# EAGLE board Cynara Viride (EAGLE 7.5.0), part 1 of 2
PCB_FINISH: ENIG; PCB_NAME: CynaraViride; PCB_SIZE_LENGTH: 160; PCB_SIZE_WIDTH: 100; PCB_X_REPEATS: 1; PCB_X_STEP: 0; PCB_Y_REPEATS: 1; PCB_Y_STEP: 0
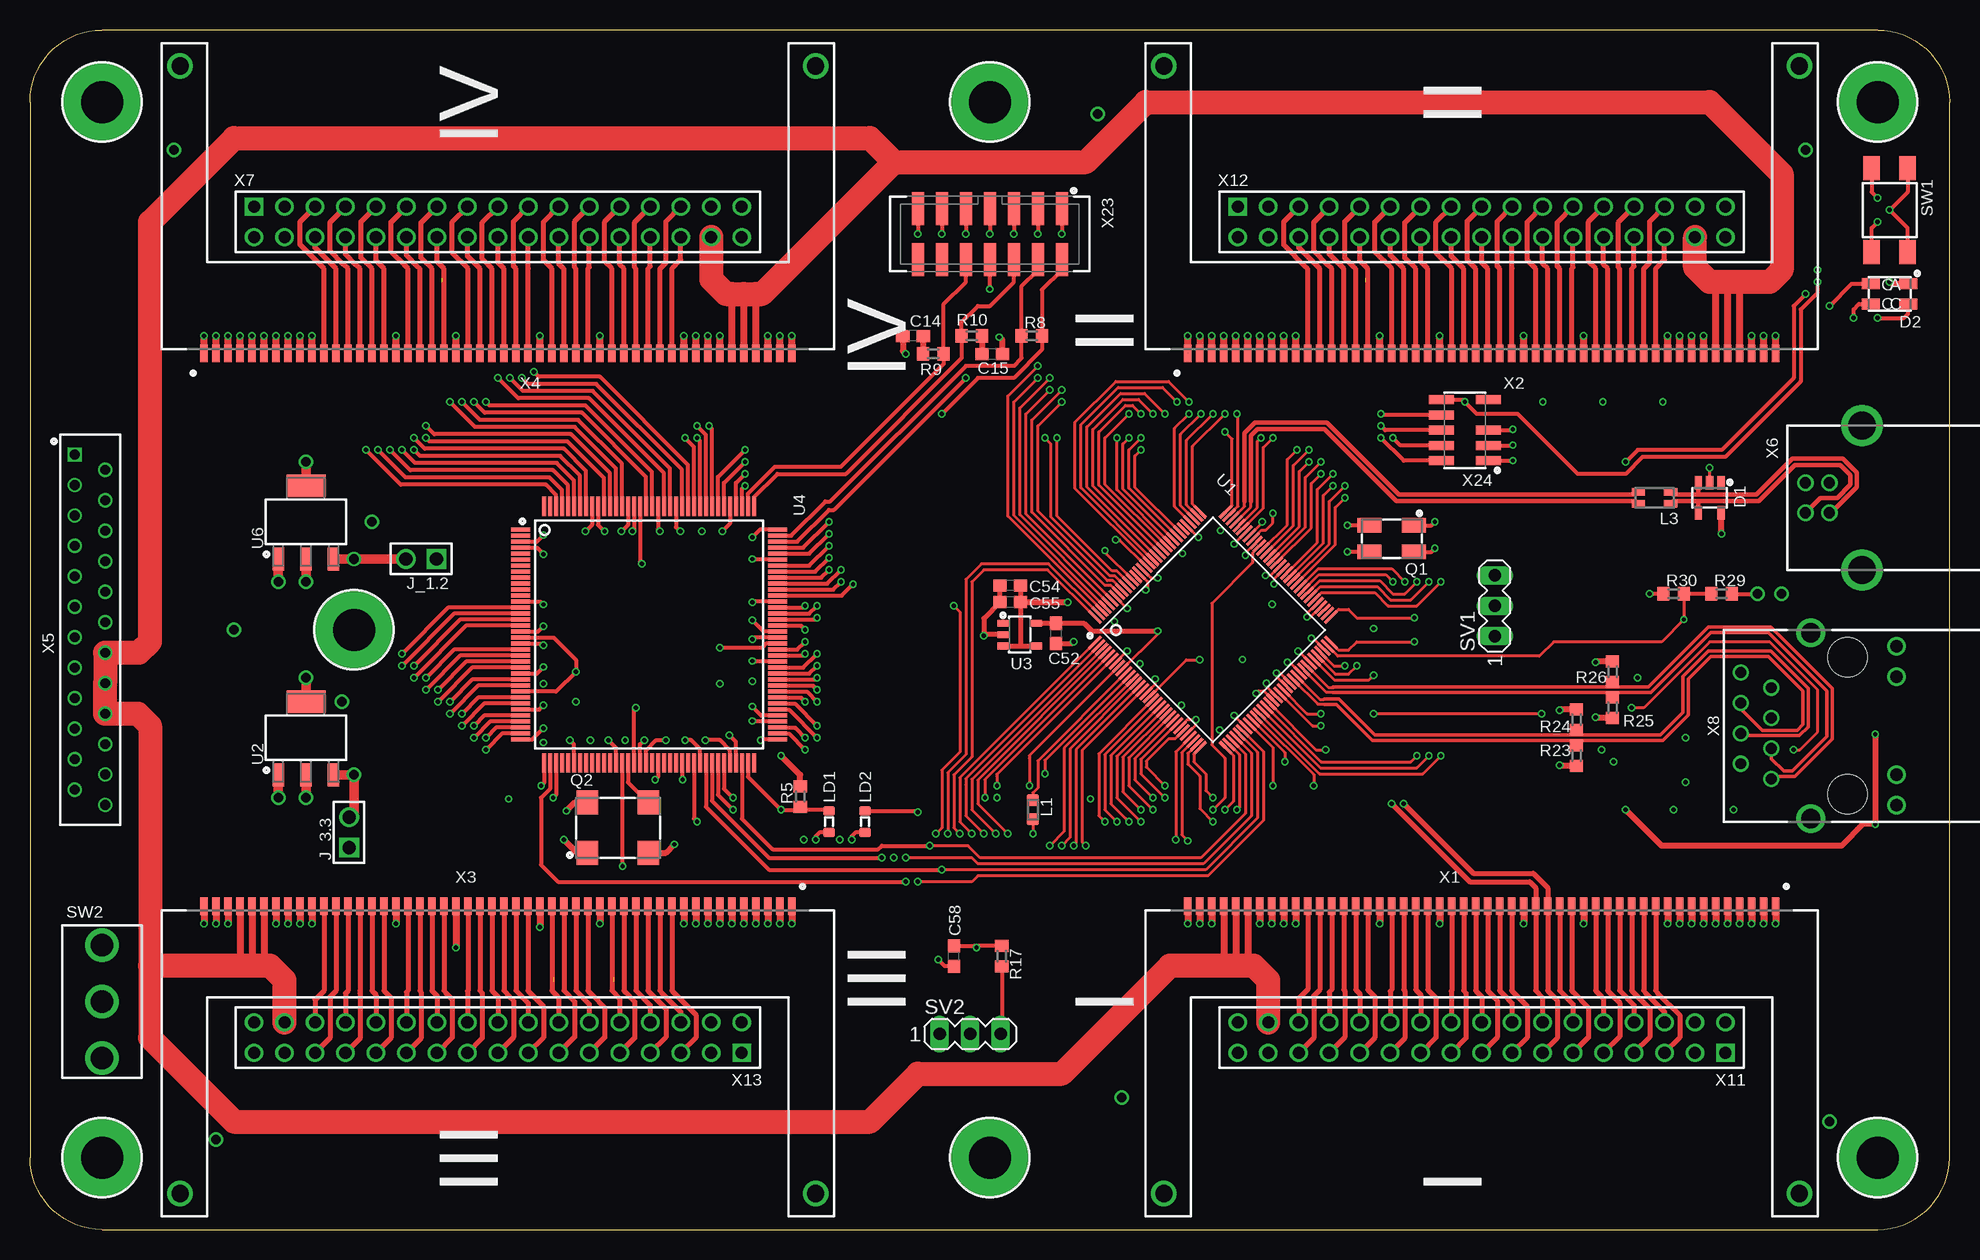
[diagram p9: board, top side]
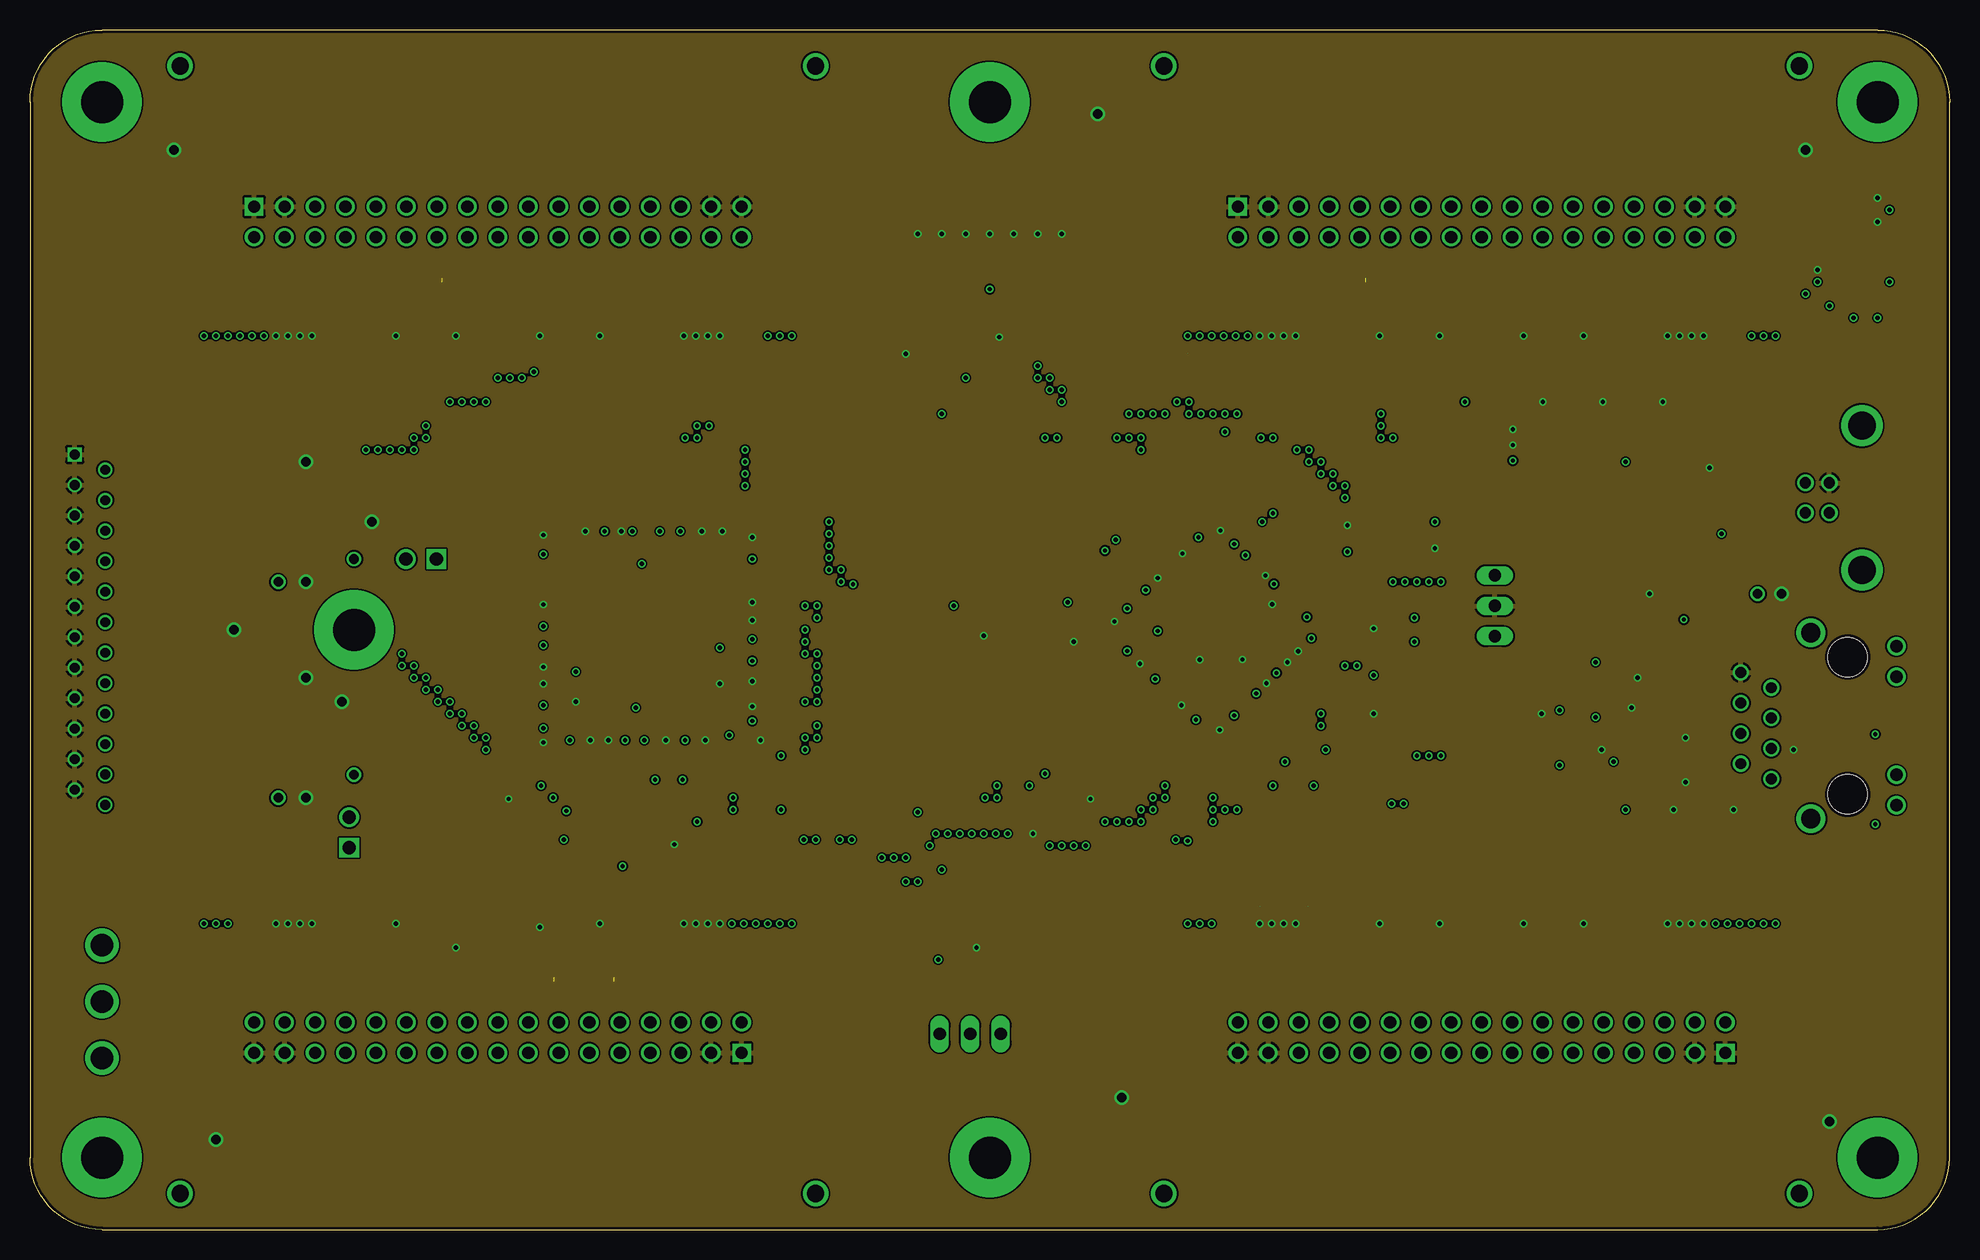
[diagram p10: board, inner layer InnerSolder]
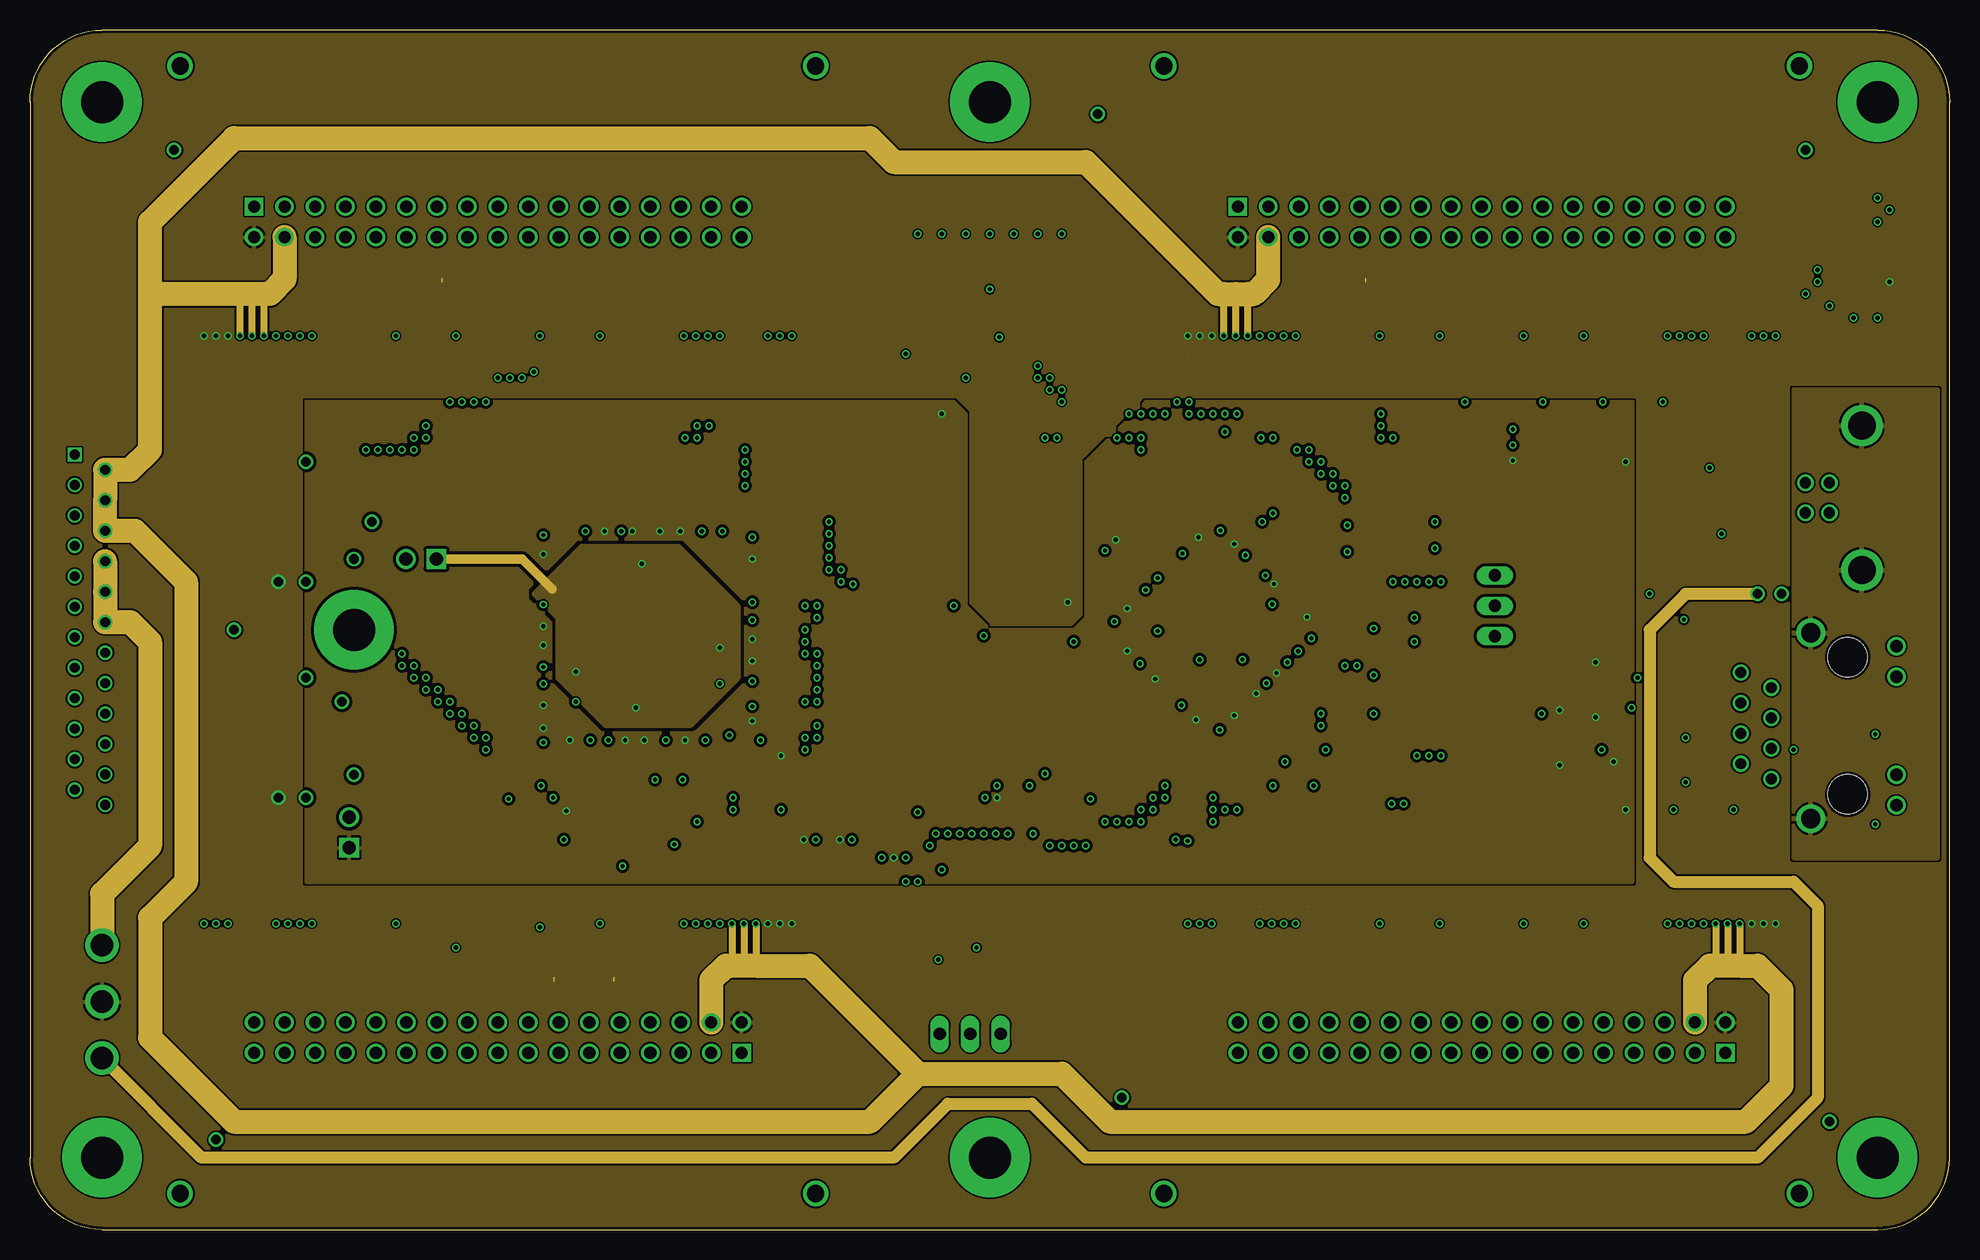
[diagram p11: board, inner layer Route15]
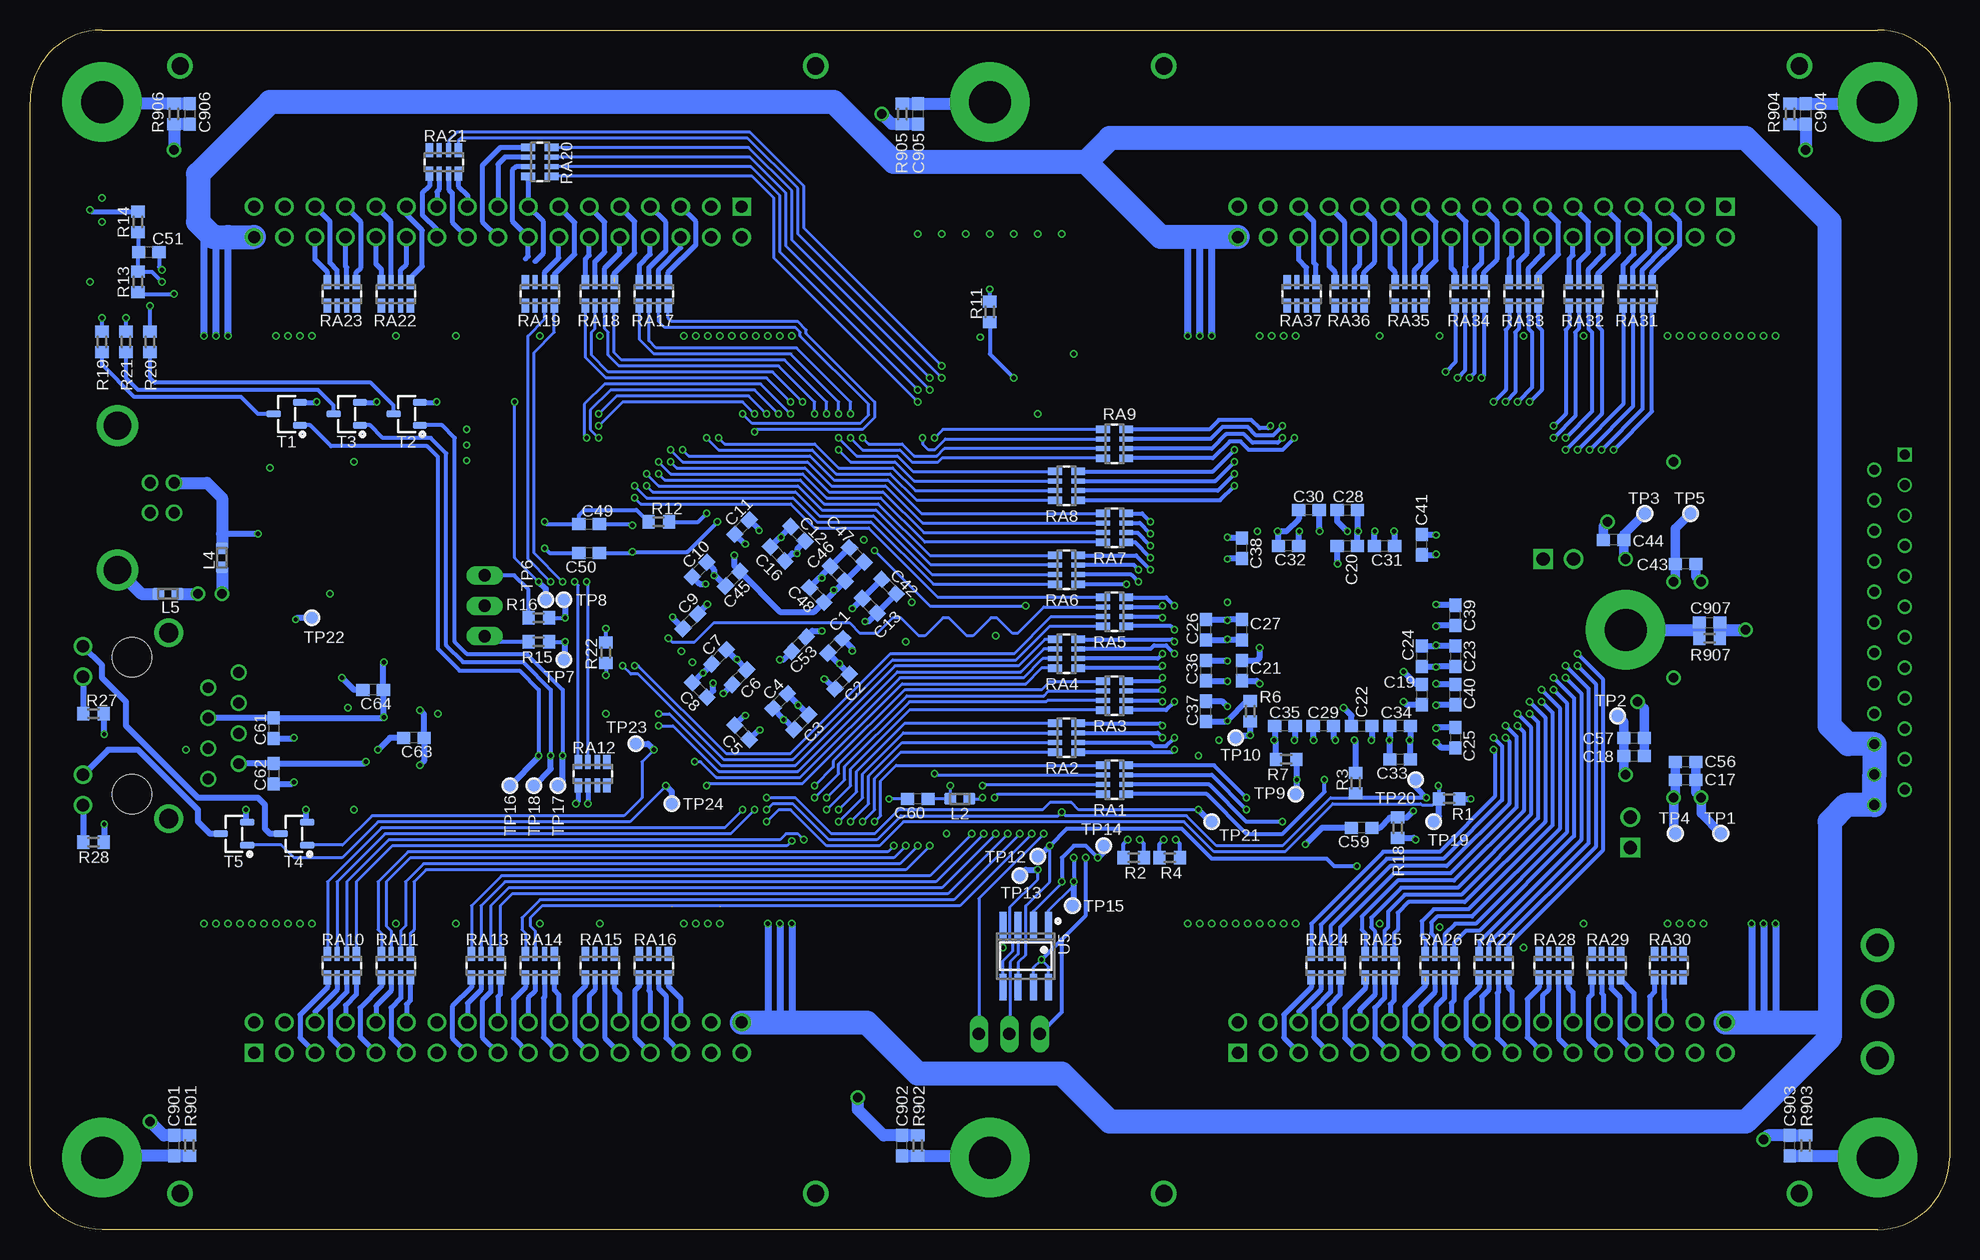
[diagram p12: board, bottom side, seen from below]

Size 160 x 100 mm. Coordinates in mm from the lower left corner, seen from the top.
Outline: 6,0 154,0 arc90 160,6 160,94 arc90 154,100 6,100 arc90 0,94 0,6 arc90 6,0
Copper layers (1+2*15+16): Top 0.018mm / dielectric 0.36mm / InnerSolder 0.035mm / dielectric 0.71mm / Route15 0.035mm / dielectric 0.2mm / Bottom 0.018mm
Design rules "eC_4Layer_PClass6_BaseCopperO18-I35_eCDefault *": minimum track width 0.15mm, minimum drill 0.35mm, track to track 0.15mm, track to pad 0.15mm, pad to pad 0.15mm, via to via 0.15mm, smd to smd 0mil, copper to edge 0.25mm, drill to drill 0.35mm, minimum pad ring 0.125mm, minimum via ring 0.125mm, stop-mask expansion 0mil, vias tented up to drill 0.45mm, thermal gap 0.2mm

## Footprints (pad centres in the part's own frame; a part is rotated, then mirrored left to right if it is on the bottom)
C0603 = smd 1.1 x 1: 1 -0.85,0; 2 0.85,0
WE-TVS_SOT23-5L = smd 0.6 x 1.1: 1 -0.95,-1.25; 2 0,-1.25; 3 0.95,-1.25; 4 0.95,1.25; 5 -0.95,1.25
3528-COMMON-ANODE = smd 1.5 x 0.9: 1 1.55,0.85; 2 1.55,-0.85; 3 -1.55,0.85; 4 -1.55,-0.85
HOLE-3,5/6,6 = drill 3.5 pad 6.6: 1 0,0
1X2 = drill 1.1 square: 1 -1.27,0 | drill 1.1: 2 1.27,0
L1608 = smd 1 x 1: 1 -0.8,0; 2 0.8,0
WE-CNSW_1206 = smd 1.1 x 0.6: 1 1.35,-0.5; 2 -1.35,-0.5; 3 -1.35,0.5; 4 1.35,0.5
LED_1608 = smd 0.8 x 1: A 0.9,0; C -0.9,0
TXC-7B = smd 2 x 1.2: 1 -1.85,-1.1; 2 1.85,-1.1; 3 1.85,1.1; 4 -1.85,1.1
TXC-7W = smd 1.8 x 2: 1 -2.54,-2.1; 2 2.54,-2.1; 3 2.54,2.1; 4 -2.54,2.1
R0603 = smd 1 x 1.1: 1 -0.85,0; 2 0.85,0
CRA06S = smd 1.15 x 0.63: 1A -0.975,1.2; 1B 0.975,1.2; 4A -0.975,-1.2; 4B 0.975,-1.2 | smd 1.15 x 0.44: 2A -0.975,0.4; 2B 0.975,0.4; 3A -0.975,-0.4; 3B 0.975,-0.4
MA03-1 = drill 1.016 long: 1 -2.54,0; 2 0,0; 3 2.54,0
430181038816 = smd 2 x 1.4: 1 -3.5,1.5; 2 3.5,1.5; 3 -3.5,-1.5; 4 3.5,-1.5
1XXX-MX-XX-C = drill 1.85: 1 0,-4.7; 2 0,0; 3 0,4.7
SOT23-3 = smd 1.2 x 0.6: 1 -1.1,0.95; 2 -1.1,-0.95; 3 1.1,0
TP-SMD = smd 1.2 x 1.2: 1 0,0
S-PQFP-G128 = smd 0.24 x 1.4: 1 -6.2,-7.7; 2 -5.8,-7.7; 3 -5.4,-7.7; 4 -5,-7.7; 5 -4.6,-7.7; 6 -4.2,-7.7; 7 -3.8,-7.7; 8 -3.4,-7.7; 9 -3,-7.7; 10 -2.6,-7.7; 11 -2.2,-7.7; 12 -1.8,-7.7; 13 -1.4,-7.7; 14 -1,-7.7; 15 -0.6,-7.7; 16 -0.2,-7.7; 17 0.2,-7.7; 18 0.6,-7.7; 19 1,-7.7; 20 1.4,-7.7; 21 1.8,-7.7; 22 2.2,-7.7; 23 2.6,-7.7; 24 3,-7.7; 25 3.4,-7.7; 26 3.8,-7.7; 27 4.2,-7.7; 28 4.6,-7.7; 29 5,-7.7; 30 5.4,-7.7; 31 5.8,-7.7; 32 6.2,-7.7; 65 6.2,7.7; 66 5.8,7.7; 67 5.4,7.7; 68 5,7.7; 69 4.6,7.7; 70 4.2,7.7; 71 3.8,7.7; 72 3.4,7.7; 73 3,7.7; 74 2.6,7.7; 75 2.2,7.7; 76 1.8,7.7; 77 1.4,7.7; 78 1,7.7; 79 0.6,7.7; 80 0.2,7.7; 81 -0.2,7.7; 82 -0.6,7.7; 83 -1,7.7; 84 -1.4,7.7; 85 -1.8,7.7; 86 -2.2,7.7; 87 -2.6,7.7; 88 -3,7.7; 89 -3.4,7.7; 90 -3.8,7.7; 91 -4.2,7.7; 92 -4.6,7.7; 93 -5,7.7; 94 -5.4,7.7; 95 -5.8,7.7; 96 -6.2,7.7 | smd 1.4 x 0.24: 33 7.7,-6.2; 34 7.7,-5.8; 35 7.7,-5.4; 36 7.7,-5; 37 7.7,-4.6; 38 7.7,-4.2; 39 7.7,-3.8; 40 7.7,-3.4; 41 7.7,-3; 42 7.7,-2.6; 43 7.7,-2.2; 44 7.7,-1.8; 45 7.7,-1.4; 46 7.7,-1; 47 7.7,-0.6; 48 7.7,-0.2; 49 7.7,0.2; 50 7.7,0.6; 51 7.7,1; 52 7.7,1.4; 53 7.7,1.8; 54 7.7,2.2; 55 7.7,2.6; 56 7.7,3; 57 7.7,3.4; 58 7.7,3.8; 59 7.7,4.2; 60 7.7,4.6; 61 7.7,5; 62 7.7,5.4; 63 7.7,5.8; 64 7.7,6.2; 97 -7.7,6.2; 98 -7.7,5.8; 99 -7.7,5.4; 100 -7.7,5; 101 -7.7,4.6; 102 -7.7,4.2; 103 -7.7,3.8; 104 -7.7,3.4; 105 -7.7,3; 106 -7.7,2.6; 107 -7.7,2.2; 108 -7.7,1.8; 109 -7.7,1.4; 110 -7.7,1; 111 -7.7,0.6; 112 -7.7,0.2; 113 -7.7,-0.2; 114 -7.7,-0.6; 115 -7.7,-1; 116 -7.7,-1.4; 117 -7.7,-1.8; 118 -7.7,-2.2; 119 -7.7,-2.6; 120 -7.7,-3; 121 -7.7,-3.4; 122 -7.7,-3.8; 123 -7.7,-4.2; 124 -7.7,-4.6; 125 -7.7,-5; 126 -7.7,-5.4; 127 -7.7,-5.8; 128 -7.7,-6.2
SOT-223 = smd 1.9 x 0.95: 1 -3.1,2.3; 2 -3.1,0; 3 -3.1,-2.3 | smd 1.9 x 3.25: 4 3,0
DBV(R-PDSO-G5) = smd 0.55 x 1: 1 -0.95,-1.35; 2 0,-1.35; 3 0.95,-1.35; 4 0.95,1.35; 5 -0.95,1.35
TQG144 = smd 0.35 x 1.6: 1 -8.35,-11.1; 2 -7.85,-11.1; 3 -7.35,-11.1; 4 -6.85,-11.1; 5 -6.35,-11.1; 6 -5.85,-11.1; 7 -5.35,-11.1; 8 -4.85,-11.1; 9 -4.35,-11.1; 10 -3.85,-11.1; 11 -3.35,-11.1; 12 -2.85,-11.1; 13 -2.35,-11.1; 14 -1.85,-11.1; 15 -1.35,-11.1; 16 -0.85,-11.1; 17 -0.35,-11.1; 18 0.15,-11.1; 19 0.65,-11.1; 20 1.15,-11.1; 21 1.65,-11.1; 22 2.15,-11.1; 23 2.65,-11.1; 24 3.15,-11.1; 25 3.65,-11.1; 26 4.15,-11.1; 27 4.65,-11.1; 28 5.15,-11.1; 29 5.65,-11.1; 30 6.15,-11.1; 31 6.65,-11.1; 32 7.15,-11.1; 33 7.65,-11.1; 34 8.15,-11.1; 35 8.65,-11.1; 36 9.15,-11.1; 73 9.15,10.3; 74 8.65,10.3; 75 8.15,10.3; 76 7.65,10.3; 77 7.15,10.3; 78 6.65,10.3; 79 6.15,10.3; 80 5.65,10.3; 81 5.15,10.3; 82 4.65,10.3; 83 4.15,10.3; 84 3.65,10.3; 85 3.15,10.3; 86 2.65,10.3; 87 2.15,10.3; 88 1.65,10.3; 89 1.15,10.3; 90 0.65,10.3; 91 0.15,10.3; 92 -0.35,10.3; 93 -0.85,10.3; 94 -1.35,10.3; 95 -1.85,10.3; 96 -2.35,10.3; 97 -2.85,10.3; 98 -3.35,10.3; 99 -3.85,10.3; 100 -4.35,10.3; 101 -4.85,10.3; 102 -5.35,10.3; 103 -5.85,10.3; 104 -6.35,10.3; 105 -6.85,10.3; 106 -7.35,10.3; 107 -7.85,10.3; 108 -8.35,10.3 | smd 1.6 x 0.35: 37 11.1,-9.15; 38 11.1,-8.65; 39 11.1,-8.15; 40 11.1,-7.65; 41 11.1,-7.15; 42 11.1,-6.65; 43 11.1,-6.15; 44 11.1,-5.65; 45 11.1,-5.15; 46 11.1,-4.65; 47 11.1,-4.15; 48 11.1,-3.65; 49 11.1,-3.15; 50 11.1,-2.65; 51 11.1,-2.15; 52 11.1,-1.65; 53 11.1,-1.15; 54 11.1,-0.65; 55 11.1,-0.15; 56 11.1,0.35; 57 11.1,0.85; 58 11.1,1.35; 59 11.1,1.85; 60 11.1,2.35; 61 11.1,2.85; 62 11.1,3.35; 63 11.1,3.85; 64 11.1,4.35; 65 11.1,4.85; 66 11.1,5.35; 67 11.1,5.85; 68 11.1,6.35; 69 11.1,6.85; 70 11.1,7.35; 71 11.1,7.85; 72 11.1,8.35; 109 -10.3,8.35; 110 -10.3,7.85; 111 -10.3,7.35; 112 -10.3,6.85; 113 -10.3,6.35; 114 -10.3,5.85; 115 -10.3,5.35; 116 -10.3,4.85; 117 -10.3,4.35; 118 -10.3,3.85; 119 -10.3,3.35; 120 -10.3,2.85; 121 -10.3,2.35; 122 -10.3,1.85; 123 -10.3,1.35; 124 -10.3,0.85; 125 -10.3,0.35; 126 -10.3,-0.15; 127 -10.3,-0.65; 128 -10.3,-1.15; 129 -10.3,-1.65; 130 -10.3,-2.15; 131 -10.3,-2.65; 132 -10.3,-3.15; 133 -10.3,-3.65; 134 -10.3,-4.15; 135 -10.3,-4.65; 136 -10.3,-5.15; 137 -10.3,-5.65; 138 -10.3,-6.15; 139 -10.3,-6.65; 140 -10.3,-7.15; 141 -10.3,-7.65; 142 -10.3,-8.15; 143 -10.3,-8.65; 144 -10.3,-9.15
SOIC127P600X120-8N = smd 2.2 x 0.6: 1 -2.6,1.905; 2 -2.6,0.635; 3 -2.6,-0.635; 4 -2.6,-1.905; 5 2.6,-1.905; 6 2.6,-0.635; 7 2.6,0.635; 8 2.6,1.905
MB1-150-01-XX-S-XX-SL = smd 0.61 x 1.448: 1 24.5,23.95; 2 23.5,23.95; 3 22.5,23.95; 4 21.5,23.95; 5 20.5,23.95; 6 19.5,23.95; 7 18.5,23.95; 8 17.5,23.95; 9 16.5,23.95; 10 15.5,23.95; 11 14.5,23.95; 12 13.5,23.95; 13 12.5,23.95; 14 11.5,23.95; 15 10.5,23.95; 16 9.5,23.95; 17 8.5,23.95; 18 7.5,23.95; 19 6.5,23.95; 20 5.5,23.95; 21 4.5,23.95; 22 3.5,23.95; 23 2.5,23.95; 24 1.5,23.95; 25 0.5,23.95; 26 -0.5,23.95; 27 -1.5,23.95; 28 -2.5,23.95; 29 -3.5,23.95; 30 -4.5,23.95; 31 -5.5,23.95; 32 -6.5,23.95; 33 -7.5,23.95; 34 -8.5,23.95; 35 -9.5,23.95; 36 -10.5,23.95; 37 -11.5,23.95; 38 -12.5,23.95; 39 -13.5,23.95; 40 -14.5,23.95; 41 -15.5,23.95; 42 -16.5,23.95; 43 -17.5,23.95; 44 -18.5,23.95; 45 -19.5,23.95; 46 -20.5,23.95; 47 -21.5,23.95; 48 -22.5,23.95; 49 -23.5,23.95; 50 -24.5,23.95 | drill 1.422 pad 2.032: 51 26.491,0; 52 -26.491,0
MICROMATCH-24-MALE = drill 0.8 square: 1 14.605,1.27 | drill 0.8: 2 13.335,-1.27; 3 12.065,1.27; 4 10.795,-1.27; 5 9.525,1.27; 6 8.255,-1.27; 7 6.985,1.27; 8 5.715,-1.27; 9 4.445,1.27; 10 3.175,-1.27; 11 1.905,1.27; 12 0.635,-1.27; 13 -0.635,1.27; 14 -1.905,-1.27; 15 -3.175,1.27; 16 -4.445,-1.27; 17 -5.715,1.27; 18 -6.985,-1.27; 19 -8.255,1.27; 20 -9.525,-1.27; 21 -10.795,1.27; 22 -12.065,-1.27; 23 -13.335,1.27; 24 -14.605,-1.27
61400416121 = drill 0.92: 1 -1.25,-4.71; 2 1.25,-4.71; 3 1.25,-2.71; 4 -1.25,-2.71 | drill 2.3: Z1 6.02,0; Z2 -6.02,0
2X17P-FEMALE = drill 1.02 square: 1 -20.32,1.27 | drill 1.02: 2 -20.32,-1.27; 3 -17.78,1.27; 4 -17.78,-1.27; 5 -15.24,1.27; 6 -15.24,-1.27; 7 -12.7,1.27; 8 -12.7,-1.27; 9 -10.16,1.27; 10 -10.16,-1.27; 11 -7.62,1.27; 12 -7.62,-1.27; 13 -5.08,1.27; 14 -5.08,-1.27; 15 -2.54,1.27; 16 -2.54,-1.27; 17 0,1.27; 18 0,-1.27; 19 2.54,1.27; 20 2.54,-1.27; 21 5.08,1.27; 22 5.08,-1.27; 23 7.62,1.27; 24 7.62,-1.27; 25 10.16,1.27; 26 10.16,-1.27; 27 12.7,1.27; 28 12.7,-1.27; 29 15.24,1.27; 30 15.24,-1.27; 31 17.78,1.27; 32 17.78,-1.27; 33 20.32,1.27; 34 20.32,-1.27
74990-WITH-LED-TYPE1 = drill 0.9: 1 4.445,-6.35; 2 3.175,-8.89; 3 1.905,-6.35; 4 0.635,-8.89; 5 -0.635,-6.35; 6 -1.905,-8.89; 7 -3.175,-6.35; 8 -4.445,-8.89 | drill 1.02: 9 6.625,4.08; 10 4.085,4.08; 11 -4.085,4.08; 12 -6.625,4.08 | drill 1.6: Z1 -7.745,-3.05; Z2 7.745,-3.05 | hole 3.25: 5.715,0; -5.715,0
87832-1420 = smd 1 x 2.75: 1 -6,-2.125; 2 -6,2.125; 3 -4,-2.125; 4 -4,2.125; 5 -2,-2.125; 6 -2,2.125; 7 0,-2.125; 8 0,2.125; 9 2,-2.125; 10 2,2.125; 11 4,-2.125; 12 4,2.125; 13 6,-2.125; 14 6,2.125
DEBUG-CORTEXM10 = smd 0.75 x 2.1: 1 -1.905,-1.95; 2 -1.905,1.95; 3 -0.635,-1.95; 4 -0.635,1.95; 5 0.635,-1.95; 6 0.635,1.95; 8 1.905,1.95; 9 3.175,-1.95; 10 3.175,1.95

## Placement (x,y rotation side)
C1  100nF  [C0603]  92.87,48.66 225 bottom
C2  100nF  [C0603]  92.31,45.69 45 bottom
C3  100nF  [C0603]  95.7,42.29 45 bottom
C4  100nF  [C0603]  97.47,44.06 45 bottom
C5  100nF  [C0603]  100.65,41.44 315 bottom
C6  100nF  [C0603]  100.86,46.04 45 bottom
C7  100nF  [C0603]  102.56,47.74 45 bottom
C8  100nF  [C0603]  104.19,44.98 315 bottom
C9  100nF  [C0603]  104.96,50.71 45 bottom
C10  100nF  [C0603]  104.19,55.02 45 bottom
C11  100nF  [C0603]  100.65,58.56 45 bottom
C12  100nF  [C0603]  95.98,57.99 315 bottom
C13  100nF  [C0603]  90,52 315 bottom
C14  47pF  [C0603]  73.6,74.5 180 top
C15  47pF  [C0603]  80.2,73 0 top
C16  2u2  [C0603]  97.69,56.32 315 bottom
C17  4u7  [C0603]  22,37.5 180 bottom
C18  1uF  [C0603]  26.3,39.5 0 bottom
C19  4u7  [C0603]  44,44.6 270 bottom
C20  4u7  [C0603]  50.2,57 0 bottom
C21  4u7  [C0603]  59,46.6 270 bottom
C22  470nF  [C0603]  49,42 0 bottom
C23  4u7  [C0603]  41.2,47.8 270 bottom
C24  4u7  [C0603]  44,47.8 270 bottom
C25  4u7  [C0603]  41.2,41 270 bottom
C26  4u7  [C0603]  62,50 90 bottom
C27  4u7  [C0603]  59,50 90 bottom
C28  4u7  [C0603]  50.2,60 0 bottom
C29  470nF  [C0603]  52.2,42 180 bottom
C30  4u7  [C0603]  53.4,60 180 bottom
C31  470nF  [C0603]  47.1,57 0 bottom
C32  470nF  [C0603]  55.1,57 180 bottom
C33  4u7  [C0603]  45.8,39.2 180 bottom
C34  470nF  [C0603]  45.8,42 180 bottom
C35  470nF  [C0603]  55.4,42 180 bottom
C36  4u7  [C0603]  62,46.6 270 bottom
C37  470nF  [C0603]  62,43.2 90 bottom
C38  470nF  [C0603]  59,56.8 90 bottom
C39  4u7  [C0603]  41.2,51.2 90 bottom
C40  470nF  [C0603]  41.2,44.6 90 bottom
C41  470nF  [C0603]  44,57.1 90 bottom
C42  2u2  [C0603]  88.4,53.6 315 bottom
C43  4u7  [C0603]  22,55.5 180 bottom
C44  1uF  [C0603]  28,57.5 180 bottom
C45  100nF  [C0603]  101.43,54.24 225 bottom
C46  2u2  [C0603]  92.66,54.67 135 bottom
C47  1uF  [C0603]  91.09,56.23 135 bottom
C48  100nF  [C0603]  94.43,52.9 135 bottom
C49  22pF  [C0603]  113.4,58.8 0 bottom
C50  22pF  [C0603]  113.4,56.4 180 bottom
C51  10nF  [C0603]  150.1,81.5 0 bottom
C52  100nF  [C0603]  85.5,49.7 270 top
C53  2u2  [C0603]  95.9,48.8 225 bottom
C54  2u2  [C0603]  81.7,53.7 180 top
C55  100nF  [C0603]  81.7,52.3 180 top
C56  100nF  [C0603]  22,39 180 bottom
C57  100nF  [C0603]  26.3,41 0 bottom
C58  100nF  [C0603]  77,22.8 90 top
C59  100nF  [C0603]  49,33.5 180 bottom
C60  100nF  [C0603]  86,35.9 180 bottom
C61  100uF  [C0603]  139.7,41.8 270 bottom
C62  100uF  [C0603]  139.7,38 270 bottom
C63  100uF  [C0603]  128,41 180 bottom
C64  100uF  [C0603]  131.4,45 180 bottom
C901  100nF  [C0603]  148,7 90 bottom
C902  100nF  [C0603]  87.3,7 90 bottom
C903  100nF  [C0603]  13.3,7 90 bottom
C904  100nF  [C0603]  12,93 270 bottom
C905  100nF  [C0603]  86,93 270 bottom
C906  100nF  [C0603]  146.7,93 270 bottom
C907  100nF  [C0603]  20,50.6 0 bottom
D1  WE-TVS_824011  [WE-TVS_SOT23-5L]  140,61 180 top
D2  WL-SFTW-150141M173100-R&G&B  [3528-COMMON-ANODE]  155,78 0 top
G901  [HOLE-3,5/6,6]  154,6 0 top
G902  [HOLE-3,5/6,6]  80,6 0 top
G903  [HOLE-3,5/6,6]  6,6 0 top
G904  [HOLE-3,5/6,6]  6,94 0 top
G905  [HOLE-3,5/6,6]  80,94 0 top
G906  [HOLE-3,5/6,6]  154,94 0 top
G907  [HOLE-3,5/6,6]  27,50 0 top
J_1.2  HDR1X2  [1X2]  32.6,55.9 180 top
J_3.3  HDR1X2  [1X2]  26.6,33.1 90 top
L1  26Z@100MHz  [L1608]  83.6,35 270 top
L2  26Z@100MHz  [L1608]  82.5,35.9 0 bottom
L3  [WE-CNSW_1206]  135.4,61 180 top
L4  300R@100MHz  [L1608]  144,56 90 bottom
L5  26Z@100MHz  [L1608]  148.5,53 180 bottom
LD1  GREEN 0603  [LED_1608]  66.6,34 270 top
LD2  YELLOW 0603  [LED_1608]  69.6,34 270 top
Q1  TXC-7B  [TXC-7B]  113.5,57.6 180 top
Q2  TXC-7WNEO  [TXC-7W]  49,33.5 0 top
R1  4k7  [R0603]  41.7,35.9 180 bottom
R2  330E  [R0603]  68,31 0 bottom
R3  4k7  [R0603]  49.5,37.2 90 bottom
R4  330E  [R0603]  65,31 0 bottom
R5  4k7  [R0603]  64.2,36.1 90 top
R6  4k7  [R0603]  58.3,43.2 90 bottom
R7  47E  [R0603]  55.3,39.2 0 bottom
R8  47k  [R0603]  83.5,74.5 0 top
R9  47E  [R0603]  75.3,73 0 top
R10  47E  [R0603]  78.5,74.5 180 top
R11  47E  [R0603]  80,76.5 90 bottom
R12  0E  [R0603]  107.6,59 0 bottom
R13  10k  [R0603]  151,79 270 bottom
R14  470E  [R0603]  151,84 270 bottom
R15  47E  [R0603]  117.6,49 0 bottom
R16  47E  [R0603]  117.6,51 0 bottom
R17  4k7  [R0603]  81,22.8 270 top
R18  0E  [R0603]  46,33.5 90 bottom
R19  70E  [R0603]  154,74 90 bottom
R20  130E  [R0603]  150,74 90 bottom
R21  70E  [R0603]  152,74 90 bottom
R22  4k87  [R0603]  112,48.1 270 bottom
R23  49E9  [R0603]  128.9,39.5 270 top
R24  49E9  [R0603]  128.9,42.5 90 top
R25  49E9  [R0603]  131.9,43.5 270 top
R26  49E9  [R0603]  131.9,46.5 90 top
R27  75E  [R0603]  154.7,43 0 bottom
R28  75E  [R0603]  154.7,32.3 0 bottom
R29  5.6K  [R0603]  141,53 0 top
R30  10K  [R0603]  137,53 0 top
R901  1M  [R0603]  146.7,7 270 bottom
R902  1M  [R0603]  86,7 270 bottom
R903  1M  [R0603]  12,7 270 bottom
R904  1M  [R0603]  13.3,93 90 bottom
R905  1M  [R0603]  87.3,93 90 bottom
R906  1M  [R0603]  148,93 90 bottom
R907  1M  [R0603]  20,49.3 180 bottom
RA1  100E  [CRA06S]  69.6,37.5 180 bottom
RA2  100E  [CRA06S]  73.6,41 180 bottom
RA3  100E  [CRA06S]  69.6,44.5 180 bottom
RA4  100E  [CRA06S]  73.6,48 180 bottom
RA5  100E  [CRA06S]  69.6,51.5 180 bottom
RA6  100E  [CRA06S]  73.6,55 180 bottom
RA7  100E  [CRA06S]  69.6,58.5 180 bottom
RA8  100E  [CRA06S]  73.6,62 180 bottom
RA9  100E  [CRA06S]  69.6,65.5 0 bottom
RA10  100E  [CRA06S]  134,22 90 bottom
RA11  100E  [CRA06S]  129.5,22 90 bottom
RA12  100E  [CRA06S]  113.1,38 90 bottom
RA13  100E  [CRA06S]  122,22 90 bottom
RA14  100E  [CRA06S]  117.5,22 90 bottom
RA15  100E  [CRA06S]  112.5,22 90 bottom
RA16  100E  [CRA06S]  108,22 90 bottom
RA17  100E  [CRA06S]  108,78 270 bottom
RA18  100E  [CRA06S]  112.5,78 270 bottom
RA19  100E  [CRA06S]  117.5,78 270 bottom
RA20  100E  [CRA06S]  117.5,89 180 bottom
RA21  100E  [CRA06S]  125.5,89 270 bottom
RA22  100E  [CRA06S]  129.5,78 270 bottom
RA23  100E  [CRA06S]  134,78 270 bottom
RA24  100E  [CRA06S]  52,22 90 bottom
RA25  100E  [CRA06S]  47.5,22 90 bottom
RA26  100E  [CRA06S]  42.5,22 90 bottom
RA27  100E  [CRA06S]  38,22 90 bottom
RA28  100E  [CRA06S]  33,22 90 bottom
RA29  100E  [CRA06S]  28.6,22 90 bottom
RA30  100E  [CRA06S]  23.4,22 90 bottom
RA31  100E  [CRA06S]  26,78 270 bottom
RA32  100E  [CRA06S]  30.5,78 270 bottom
RA33  100E  [CRA06S]  35.5,78 270 bottom
RA34  100E  [CRA06S]  40,78 270 bottom
RA35  100E  [CRA06S]  45,78 270 bottom
RA36  100E  [CRA06S]  50,78 270 bottom
RA37  100E  [CRA06S]  54,78 270 bottom
SV1  [MA03-1]  122.1,52 90 top
SV2  [MA03-1]  78.37,16.3 0 top
SW1  430181038816  [430181038816]  155,85 270 top
SW2  [1XXX-MX-XX-C]  6,19 0 top
T1  PDTC143  [SOT23-3]  138.6,68 180 bottom
T2  PDTC143  [SOT23-3]  128.6,68 180 bottom
T3  PDTC143  [SOT23-3]  133.6,68 180 bottom
T4  PDTC143  [SOT23-3]  138,33 180 bottom
T5  PDTC143  [SOT23-3]  143,33 180 bottom
TP1  [TP-SMD]  19.05,33.02 0 bottom
TP2  [TP-SMD]  27.67,42.82 0 bottom
TP3  [TP-SMD]  25.4,59.69 0 bottom
TP4  [TP-SMD]  22.86,33.02 0 bottom
TP5  [TP-SMD]  21.59,59.69 0 bottom
TP6  [TP-SMD]  117,52.5 0 bottom
TP7  [TP-SMD]  115.5,47.5 0 bottom
TP8  [TP-SMD]  115.5,52.5 0 bottom
TP9  [TP-SMD]  54.5,36.3 0 bottom
TP10  [TP-SMD]  59.5,41 0 bottom
TP12  [TP-SMD]  76,31.1 0 bottom
TP13  [TP-SMD]  77.5,29.5 0 bottom
TP14  [TP-SMD]  70.5,32 0 bottom
TP15  [TP-SMD]  73.1,27 0 bottom
TP16  [TP-SMD]  120,37 0 bottom
TP17  [TP-SMD]  116,37 0 bottom
TP18  [TP-SMD]  118,37 0 bottom
TP19  [TP-SMD]  43,34 180 bottom
TP20  [TP-SMD]  44.5,37.5 0 bottom
TP21  [TP-SMD]  61.5,34 0 bottom
TP22  [TP-SMD]  136.5,51 0 bottom
TP23  [TP-SMD]  109.5,40.5 0 bottom
TP24  [TP-SMD]  106.5,35.5 0 bottom
U1  TM4C129EN  [S-PQFP-G128]  98.6,50 315 top
U2  MCP1826S 3V3  [SOT-223]  23,41 90 top
U3  LM4132 3V3  [DBV(R-PDSO-G5)]  82.5,49.6 270 top
U4  XC6SLX9-3TQG  [TQG144]  52,50 270 top
U5  M25P16-SO8  [SOIC127P600X120-8N]  77,22.8 270 bottom
U6  MCP1826S 1V2  [SOT-223]  23,59 90 top
U$21  CYNARA_FRONT  [CYNARA_BELOW_W15MM]  87.6,54.9 90 top
X1  EDGE 50p  [MB1-150-01-XX-S-XX-SL]  121,3 0 top
X2  EDGE 50p  [MB1-150-01-XX-S-XX-SL]  121,97 180 top
X3  EDGE 50p  [MB1-150-01-XX-S-XX-SL]  39,3 0 top
X4  EDGE 50p  [MB1-150-01-XX-S-XX-SL]  39,97 180 top
X5  MicroMatch 24  [MICROMATCH-24-MALE]  5,50 90 top
X6  [61400416121]  152.7,61 270 top
X7  SOCK2X17  [2X17P-FEMALE]  39,84 0 top
X8  RJ45-LAN-10/100  [74990-WITH-LED-TYPE1]  151.5,42 270 top
X11  SOCK2X17  [2X17P-FEMALE]  121,16 180 top
X12  SOCK2X17  [2X17P-FEMALE]  121,84 0 top
X13  SOCK2X17  [2X17P-FEMALE]  39,16 180 top
X23  debug xilinx  [87832-1420]  80,83 180 top
X24  debug 10p  [DEBUG-CORTEXM10]  119.6,66 90 top

## Tracks (layer width: path | path; a pad name or v marks a point on that pad's centre or on a via)
5V_USB  (via drill 0.8)
  Top 0.35: R29.2 v144,53
  Route15 1: v144,53 138,53 135,50 135,31 137,29 147,29 149,27 149,11 144,6 88,6 83.5,10.5 76.5,10.5 72,6 14.3,6 SW2.1
  Bottom 1: L4.1 v144,53
!HIB  (via drill 0.35)
  Top 0.24: v115.4,51 110.6,51 109.9,51.7 109.07,51.7 U1.65
  Bottom 0.35: R16.2 v115.4,51
  Bottom 0.5: TP8.1 115.4,52.4 v115.4,51
!RST  (via drill 0.35)
  Top 0.24: v117.6,54 115.6,52 113.2,52 112.1,53.1 107.64,53.1 U1.70
  Top 0.35: X24.10 119.42,69.17 v119.6,69 120.6,68 124,68 129,63 133,63 134.4,64.4 141.3,64.4 147.6,70.7 147.6,76.7 149,78.1 v149,79
  Bottom 0.24: v117.6,54 119.6,56 v119.6,69
  Bottom 0.35: R14.2 151,81.55 C51.1 151,81.45 R13.1 149.85,79.85 v149,79
  Bottom 0.5: TP6.1 117,53.4 v117.6,54
!WAKE  (via drill 0.35)
  Top 0.24: v115.4,49 110.6,49 109.9,48.3 109.06,48.3 U1.64
  Bottom 0.35: R15.2 v115.4,49
  Bottom 0.5: TP7.1 115.4,47.6 v115.4,49
+1.2V  (via drill 0.35)
  Top 0.35: U4.89 61.35,48.85 61,48.5 v57.5,48.5 | U4.52 50.35,43.35 v50.5,43.5 | U4.128 50.85,55.65 v51,55.5 | U4.19 43.65,49.35 45.5,47.5 v45.5,46.5 43.85,44.85 U4.28
  Route15 0.8: J_1.2.1 41,55.9 43.5,53.4
  Bottom 0.35: C22.1 49.92,42.16
  Bottom 0.5: C21.1 57.75,47.45 57.5,47.7 v57.5,48.5 | C22.1 49.85,42.85 v50.5,43.5 | C20.1 51.05,55.55 v51,55.5 | C19.1 44.45,45.45 v45.5,46.5
  pour Route15: 44,46 44,51 42,53 46,57 54,57 59,52 59,46 55,42 48,42
+3.3V  (via drill 0.35)
  Top 0.24: 93.79,45.48 v93.79,45.9 93.79,45.48 | v102.21,44.7 102.41,44.9 102.85,44.9 U1.47 | U1.26 | U1.26 96.48,42.51 v97.19,42.51 97.19,42.08 U1.28 | U1.39 v100.37,42.86 | v100.37,42.86 | U1.68 106.73,51.06 v106.45,51.06 106.45,51.34 U1.69 | U1.90 v100.37,57.14 | v100.37,57.14 | U1.101 v97.4,57.71 | v97.4,57.71 | U1.122 v91.46,51.77 | v91.46,51.77 | U1.7 v91.46,48.23 | v91.46,48.23 | U1.79 103.69,54.24 v103.69,53.82 | U1.51 103.9,46.11 v103.9,46.39 104.19,46.39 U1.52 | U1.16 93.79,45.48 | U1.113 90.82,57.5 v90.5,57.5
  Top 0.35: C58.1 76.25,21.95 v75.7,22.5 | X24.1 v123.59,64.09 v123.6,64.1 | U4.42 45.35,40.45 v45,40.8 | U4.53 50.85,40.45 v51.2,40.8 | U4.63 55.85,40.05 55.1,40.8 v54.6,40.8 | U4.76 60.25,42.35 v60.2,42.4 | U4.86 60.25,47.35 v60.2,47.4 | U4.90 60.35,49.35 v60.2,49.2 | U4.103 60.25,55.85 v60.2,55.9 | U4.122 53.85,58.55 v54.2,58.2 | U4.125 52.35,58.35 v52.5,58.2 | U4.129 50.35,58.35 v50.2,58.2 | U4.135 47.35,58.75 v47.9,58.2 | U4.4 42.25,56.85 v42.8,56.3 | U4.18 42.35,49.85 v42.8,50.3 | U4.20 42.65,48.85 v42.8,48.7 | U4.31 42.45,43.35 v42.8,43.7 | U4.36 41.85,40.85 v42.8,41.8 | X23.2 86,80 84.35,78.35 R8.2 84.35,73.35 82,71 79,71 v76,68 | v133,64 134,65 141,65 147,71 147,77 v148,78
  Top 0.5: R5.2 64.2,37.9 v62.6,39.5 | Q2.4 45.4,35.6 v44.7,34.9 | v153.8,41.3 v153.8,33.8 152.8,33.8 151,32 136,32 v133,35 | R26.2 130.55,47.35 v130.5,47.3 | R25.2 130.55,42.65 v130.5,42.7 | R24.2 127.55,43.35 v127.5,43.3 | R23.2 127.55,38.65 v127.5,38.7
  Bottom 0.24: C4.1 98.34,43.27 | U5.8 75.09,21.89 v75.7,22.5 76.36,21.84 U5.7 | L2.2 80.7,35.9 v80.6,36
  Bottom 0.35: v75.7,22.5 74,24.2 | SV2.1 74,18.13 74,24.2 | R4.2 64.15,32.15 v64.5,32.5 | R2.2 67.15,32.15 v67.5,32.5 | 74,24.2 72,26.2 v72,31 | R13.2 150.85,78 v148,78
  Bottom 0.5: X8.2 142.59,38.85 C62.1 132.15,38.85 v132,39 | X8.5 145.13,42.65 C61.1 130.55,42.65 v130.5,42.7 130.55,42.75 C64.1 130.55,47.25 v130.5,47.3 | C1.1 91.46,48.44 v91.46,48.23 | C2.1 93.72,45.9 v93.79,45.9 | C3.1 97.11,42.51 v97.19,42.51 97.19,42.58 C4.1 | C5.1 100.44,42.86 v100.37,42.86 | C6.1 v102.21,44.7 | C7.1 v103.9,46.39 103.97,46.39 C8.1 | C9.1 106.45,50.99 v106.45,51.06 | C10.1 104.19,53.82 v103.69,53.82 | C11.1 100.44,57.14 v100.37,57.14 | C16.1 97.5,57.71 v97.4,57.71 97.4,57.78 C12.1 | C42.1 C13.1 91.43,51.77 v91.46,51.77 | C33.1 44.95,40.75 v45,40.8 44.95,40.85 C34.1 | C29.1 51.35,40.95 v51.2,40.8 | C35.1 54.55,40.85 v54.6,40.8 | R6.2 58.55,44.05 v60.2,42.4 60.25,42.35 C37.1 | C36.1 60.25,47.45 v60.2,47.4 | C27.1 60.15,49.15 v60.2,49.2 60.25,49.15 C26.1 | C38.1 60.15,55.95 v60.2,55.9 | C32.1 54.25,58.15 v54.2,58.2 | C30.1 52.55,58.25 v52.5,58.2 | C28.1 51.05,59.05 v50.2,58.2 | C31.1 47.95,58.15 v47.9,58.2 | C41.1 42.85,56.25 v42.8,56.3 | C39.1 42.75,50.35 v42.8,50.3 | C24.1 42.85,48.65 v42.8,48.7 42.75,48.65 C23.1 | C40.1 42.75,43.75 v42.8,43.7 | C25.1 42.75,41.85 v42.8,41.8 | R3.2 49.5,40.7 v49.6,40.8 | v44.7,34.9 45.25,34.35 R18.2 46.65,34.35 47.5,33.5 C59.1 | R27.2 153.85,41.35 v153.8,41.3 | v153.8,33.8 153.8,32.35 R28.2 | v127.5,43.3 127.15,42.95 C63.1 127.15,39.05 v127.5,38.7
  pour Route15 (isolate 0.254, rank 3): 133.6,29 133.6,69 93,69 88,64 88,51 87,50 80,50 78,52 78,68 77,69 23,69 23,29
+5V  (via drill 0.35, 0.8)  (1 unrouted)
  Top 0.4: C54.1 C55.1 82.55,48.7 82.5,48.65 | U3.3 82.5,48.65 | 82.5,48.65 U3.4
  Top 0.45: D2.1 155.15,78.85 v155,79
  Top 0.5: C55.1 v86.5,52.3
  Top 0.6: X3.3 v61.5,25.5 | X3.2 v62.5,25.5 | X3.1 v63.5,25.5 | X2.1 v96.5,74.5 | v97.5,74.5 X2.2 | X2.3 v98.5,74.5 | X1.3 v143.5,25.5 | X1.2 v144.5,25.5 | X1.1 v145.5,25.5 | X4.1 v14.5,74.5 | X4.2 v15.5,74.5 | X4.3 v16.5,74.5
  Top 0.8: U6.1 v20.7,54 | U2.1 v20.7,36
  Bottom 0.8: C56.1 C17.1 21.15,36.45 v20.7,36 20.7,34.67 TP1.1 | C43.1 21.15,54.45 v20.7,54
  pour Route15 (rank 6): 160,100 0,100 0,0 160,0
D_N
  Top 0.37: L3.3 136.99,60.74 139.05,60.74 | D1.4 139.05,60.74 | X6.2 149.24,61 150.63,61 151.74,62.11 151.74,62.89 150.89,63.74 147.11,63.74 144.11,60.74 139.05,60.74
D_P
  Top 0.37: L3.2 136.99,61.26 139.05,61.26 | D1.3 139.05,61.26 | X6.3 150.12,59.75 152.26,61.89 152.26,63.11 151.11,64.26 146.89,64.26 143.89,61.26 139.05,61.26
DONE  (via drill 0.35)
  Top 0.24: v98.6,36 98,36.6 98,38 97,39 97,39.63 U1.32
  Top 0.35: LD1.C 66.5,35 64.45,35 R5.1 63.95,35 v62.6,35 59.85,37.75 U4.71
  Bottom 0.24: v98.6,36 96.2,36 93.2,33 89.6,33 87.6,35 75.6,35 75,35.6 73.2,35.6 72.6,35 v62.6,35
  Bottom 0.5: TP21.1 61.6,34 v62.6,35
EPI0S0  (via drill 0.35)
  Top 0.24: 89.3,34.3 v89.6,34 89.1,34.5 89.1,39.65 U1.18
  Bottom 0.24: v89.6,34 89.1,34.5 89.1,37.4 87.8,38.7 RA1.4B
EPI0S1  (via drill 0.35)
  Top 0.24: v90.6,34 89.6,35 89.6,39.59 U1.19
  Bottom 0.24: v90.6,34 89.6,35 89.6,37.6 87.4,39.8 RA2.1B
EPI0S2  (via drill 0.35)
  Top 0.24: 91.3,34.3 v91.6,34 90.1,35.5 90.1,39.52 U1.20
  Bottom 0.24: v91.6,34 90.1,35.5 90.1,37.8 87.3,40.6 RA2.2B
EPI0S3  (via drill 0.35)
  Top 0.24: v92.6,34 90.6,36 90.6,39.45 U1.21
  Bottom 0.24: v92.6,34 90.6,36 90.6,38 87.2,41.4 RA2.3B
EPI0S4  (via drill 0.35)
  Top 0.24: v92.6,35 91.1,36.5 91.1,39.39 U1.22
  Bottom 0.24: v92.6,35 91.1,36.5 91.1,38.2 87.1,42.2 RA2.4B
EPI0S5  (via drill 0.35)
  Top 0.24: v93.6,35 91.6,37 91.6,39.32 U1.23
  Bottom 0.24: v93.6,35 91.6,37 91.6,38.4 86.7,43.3 RA3.1B
EPI0S6  (via drill 0.35)
  Top 0.24: v93.6,36 92.1,37.5 92.1,39.26 U1.24
  Bottom 0.24: RA3.2B 75.2,44.1 75.3,44 86.7,44 92.1,38.6 92.1,37.5 v93.6,36
EPI0S7  (via drill 0.35)
  Top 0.24: v94.6,36 92.6,38 92.6,39.19 U1.25
  Bottom 0.24: RA3.3B 75.1,44.9 75.5,44.5 86.9,44.5 92.6,38.8 92.6,38 v94.6,36
EPI0S8  (via drill 0.35)
  Top 0.24: v103.6,37 103.6,40.19 U1.40
  Bottom 0.24: v103.6,37 103.4,37.2 95.6,37.2 87.3,45.5 77,45.5 75.7,46.8 RA4.1B
EPI0S9  (via drill 0.35)
  Top 0.24: v104.6,39 104.6,39.76 U1.41
  Bottom 0.24: v104.6,39 104.1,39 102.8,37.7 95.8,37.7 87.5,46 77.2,46 75.6,47.6 RA4.2B
EPI0S10  (via drill 0.35)
  Top 0.24: v107.6,43 106.45,43 U1.50
  Bottom 0.24: v107.6,43 106.7,43 102.4,38.7 96.2,38.7 87.9,47 77.6,47 75.4,49.2 RA4.4B
EPI0S11  (via drill 0.35)
  Top 0.24: v107.6,42 106.9,42 106.88,42 U1.49
  Bottom 0.24: v107.6,42 106.4,42 102.6,38.2 96,38.2 87.7,46.5 77.4,46.5 75.5,48.4 RA4.3B
EPI0S12  (via drill 0.35)
  Top 0.24: v109.6,61 108.8,60.2 108.8,57.09 U1.75
  Bottom 0.24: v109.6,61 109.1,60.5 96.6,60.5 94.6,58.5 90.1,58.5 84.3,52.7 RA5.4B
EPI0S13  (via drill 0.35)
  Top 0.24: v109.6,62 108.3,60.7 108.3,57.15 U1.76
  Bottom 0.24: v109.6,62 108.6,61 96.4,61 94.4,59 89.9,59 84.7,53.8 RA6.1B
EPI0S14  (via drill 0.35)
  Top 0.24: v108.6,62 107.8,61.2 107.8,57.22 U1.77
  Bottom 0.24: v108.6,62 108.1,61.5 96.2,61.5 94.2,59.5 89.7,59.5 84.8,54.6 RA6.2B
EPI0S15  (via drill 0.35)
  Top 0.24: v108.6,63 107.3,61.7 107.3,57.29 U1.78
  Bottom 0.24: v108.6,63 107.6,62 96,62 94,60 89.5,60 84.9,55.4 RA6.3B
EPI0S16  (via drill 0.35)
  Top 0.24: v107.6,63 106.8,62.2 106.8,58.48 U1.81
  Bottom 0.24: v107.6,63 107.1,62.5 95.8,62.5 93.8,60.5 89.3,60.5 85,56.2 RA6.4B
EPI0S17  (via drill 0.35)
  Top 0.24: v107.6,64 106.3,62.7 106.3,58.55 U1.82
  Bottom 0.24: v107.6,64 106.6,63 95.6,63 93.6,61 89.1,61 85.4,57.3 RA7.1B
EPI0S18  (via drill 0.35)
  Top 0.24: v106.6,64 105.8,63.2 105.8,58.61 U1.83
  Bottom 0.24: v106.6,64 106.1,63.5 95.4,63.5 93.4,61.5 88.9,61.5 85.5,58.1 RA7.2B
EPI0S19  (via drill 0.35)
  Top 0.24: v106.6,65 105.3,63.7 105.3,58.68 U1.84
  Bottom 0.24: v106.6,65 105.6,64 95.2,64 93.2,62 88.7,62 85.6,58.9 RA7.3B
EPI0S20  (via drill 0.35)
  Top 0.24: v79.6,36 79.6,37.51 U1.5
  Bottom 0.24: RA1.1B 79.3,36.3 v79.6,36
EPI0S21  (via drill 0.35)
  Top 0.24: v80.6,37 80.6,37.8 80.6,37.94 U1.6
  Bottom 0.24: RA1.2B 80.5,37.1 v80.6,37
EPI0S22  (via drill 0.35)
  Top 0.24: v84.6,38 84.6,39.11 U1.11
  Bottom 0.24: RA1.3B 84.5,37.9 v84.6,38
EPI0S23  (via drill 0.35)
  Top 0.24: v94.6,37 93.05,38.55 93.05,39.05 94.9,40.9 95.44,40.9 U1.27
  Bottom 0.24: RA3.4B 75,45.7 75.7,45 87.1,45 93.05,39.05 93.05,38.55 v94.6,37
EPI0S24  (via drill 0.35)
  Top 0.24: v110.6,47 109.9,46.3 108.81,46.3 U1.60
  Bottom 0.24: RA5.1B 75,50.3 77.8,47.5 88.1,47.5 96.4,39.2 102.2,39.2 109.3,46.3 109.9,46.3 v110.6,47
EPI0S25  (via drill 0.35)
  Top 0.24: v109.6,47 108.67,47 U1.61
  Bottom 0.24: RA5.2B 74.9,51.1 78,48 88.3,48 96.6,39.7 102,39.7 109.3,47 v109.6,47
EPI0S26  (via drill 0.35)
  Top 0.24: v105.6,65 104.8,64.2 104.8,58.75 U1.85
  Bottom 0.24: v105.6,65 105.1,64.5 95,64.5 93,62.5 88.5,62.5 85.7,59.7 RA7.4B
EPI0S27  (via drill 0.35)
  Top 0.24: v103.6,66 102.8,65.2 102.8,60.14 U1.91
  Bottom 0.24: v103.6,66 102.6,65 94.8,65 92.8,63 88.3,63 86.1,60.8 RA8.1B
EPI0S28  (via drill 0.35)
  Top 0.24: v102.6,66 102.3,65.7 102.3,60.2 U1.92
  Bottom 0.24: v102.6,66 102.1,65.5 94.6,65.5 92.6,63.5 88.1,63.5 86.2,61.6 RA8.2B
EPI0S29  (via drill 0.35)
  Top 0.24: v92.6,65 92.1,64.5 92.1,61.87 U1.103
  Bottom 0.24: v92.6,65 91.6,64 87.9,64 86.3,62.4 RA8.3B
EPI0S30  (via drill 0.35)
  Top 0.24: v92.6,66 91.6,65 91.6,61.81 U1.104
  Bottom 0.24: v92.6,66 91.1,64.5 87.7,64.5 86.4,63.2 RA8.4B
EPI0S31  (via drill 0.35)
  Top 0.24: U1.62 106.94,49.3 v106.8,49.3
  Bottom 0.24: v106.8,49.3 106.5,49 104.6,49 103,50.6 91.7,50.6 90.8,49.7 89.4,49.7 88.1,51 87.4,51 85.9,49.5 85.4,49.5 83.9,51 83.4,51 81.9,49.5 81.4,49.5 79.9,51 79.4,51 78.1,49.7 77.7,49.7 75.5,51.9 RA5.3B
ETH_PAIR0_N
  Top 0.24: 108.59,44.77 108.56,44.8 108.04,44.8 U1.56
  Top 0.3: 108.59,44.77 131.9,44.77 | 131.9,44.77 135.09,44.77 140.09,49.77 144.91,49.77 149.78,44.91 149.78,41.09 146.91,38.23 146.18,38.23 145.15,39.25 X8.3 | R25.1 131.9,44.77
ETH_PAIR0_P
  Top 0.24: 108.7,45.23 108.67,45.2 108.21,45.2 U1.57
  Top 0.3: 108.59,45.23 108.7,45.23 131.6,45.23 | 131.6,45.23 134.91,45.23 139.91,50.23 145.09,50.23 150.22,45.09 150.22,40.91 147.09,37.77 145.37,37.77 X8.1 | R26.1 131.9,45.52 131.6,45.23
ETH_PAIR1_N
  Top 0.24: 107.89,43.77 107.86,43.8 107.34,43.8 U1.53
  Top 0.3: 107.89,43.77 108.91,43.77 111.91,40.77 128.8,40.77 | R23.1 128.9,40.67 128.8,40.77 | X8.6 142.61,43.39 144.38,41.62 147.31,41.62 147.78,42.09 147.78,44.91 144.91,47.77 140.09,47.77 138.22,45.91 138.22,42.91 136.09,40.77 128.8,40.77
ETH_PAIR1_P
  Top 0.24: 107.89,44.23 107.86,44.2 107.52,44.2 U1.54
  Top 0.3: 107.89,44.23 109.09,44.23 112.09,41.23 128.9,41.23 | R24.1 128.9,41.23 | X8.4 142.8,41.17 147.49,41.17 148.22,41.91 148.22,45.09 145.09,48.23 139.91,48.23 137.78,46.09 137.78,43.09 135.91,41.23 128.9,41.23
FPGA_EPI0S0  (via drill 0.35)
  Top 0.35: v58.6,36 57.85,36.75 U4.67
  Bottom 0.35: RA1.4A 61.3,38.7 v58.6,36
FPGA_EPI0S1  (via drill 0.35)
  Top 0.35: v64.6,40 63.25,41.35 U4.74
  Bottom 0.35: RA2.1A 64.8,39.8 v64.6,40
FPGA_EPI0S2  (via drill 0.35)
  Top 0.35: v64.6,41 63.8,41.8 63.78,41.82 63.75,41.85 U4.75
  Bottom 0.35: RA2.2A 66.6,40.6 66.3,40.3 65.3,40.3 v64.6,41
FPGA_EPI0S3  (via drill 0.35)
  Top 0.35: v65.6,41 63.25,43.35 U4.78
  Bottom 0.35: RA2.3A 66,41.4 v65.6,41
FPGA_EPI0S4  (via drill 0.35)
  Top 0.35: v65.6,42 63.75,43.85 U4.79
  Bottom 0.35: RA2.4A 65.8,42.2 v65.6,42
FPGA_EPI0S5  (via drill 0.35)
  Top 0.35: 64.28,44.32 v64.6,44 64.25,44.35 U4.80
  Bottom 0.35: RA3.1A 65.3,43.3 v64.6,44
FPGA_EPI0S6  (via drill 0.35)
  Top 0.35: v65.6,44 64.75,44.85 U4.81
  Bottom 0.35: RA3.2A 65.7,44.1 v65.6,44
FPGA_EPI0S7  (via drill 0.35)
  Top 0.35: 65.28,45.32 v65.6,45 65.25,45.35 U4.82
  Bottom 0.35: RA3.3A 65.7,44.9 v65.6,45
FPGA_EPI0S8  (via drill 0.35)
  Top 0.35: U4.84 64.95,46.35 v65.6,47
  Bottom 0.35: RA4.1A 65.8,46.8 v65.6,47
FPGA_EPI0S9  (via drill 0.35)
  Top 0.35: U4.85 64.45,46.85 v65.6,48
  Bottom 0.35: RA4.2A 66,47.6 v65.6,48
FPGA_EPI0S10  (via drill 0.35)
  Top 0.35: U4.88 63.95,48.35 v64.6,49
  Bottom 0.35: RA4.4A 64.8,49.2 v64.6,49
FPGA_EPI0S11  (via drill 0.35)
  Top 0.35: U4.87 64.45,47.85 v64.6,48
  Bottom 0.35: RA4.3A 66.6,48.4 66.3,48.7 65.3,48.7 v64.6,48
FPGA_EPI0S12  (via drill 0.35)
  Top 0.35: U4.95 64.45,51.85 v64.6,52
  Bottom 0.35: RA5.4A 65.3,52.7 v64.6,52
FPGA_EPI0S13  (via drill 0.35)
  Top 0.35: U4.97 67.65,52.85 v68.6,53.8
  Bottom 0.35: RA6.1A v68.6,53.8
FPGA_EPI0S14  (via drill 0.35)
  Top 0.35: U4.98 66.95,53.35 v67.6,54
  Bottom 0.35: RA6.2A 68.2,54.6 v67.6,54
FPGA_EPI0S15  (via drill 0.35)
  Top 0.35: U4.99 66.45,53.85 v67.6,55
  Bottom 0.35: RA6.3A 68,55.4 v67.6,55
FPGA_EPI0S16  (via drill 0.35)
  Top 0.35: U4.100 65.95,54.35 v66.6,55
  Bottom 0.35: RA6.4A 67.8,56.2 v66.6,55
FPGA_EPI0S17  (via drill 0.35)
  Top 0.35: U4.101 65.45,54.85 v66.6,56
  Bottom 0.35: RA7.1A 67.9,57.3 v66.6,56
FPGA_EPI0S18  (via drill 0.35)
  Top 0.35: U4.102 64.95,55.35 v66.6,57
  Bottom 0.35: RA7.2A 67.7,58.1 v66.6,57
FPGA_EPI0S19  (via drill 0.35)
  Top 0.35: U4.104 64.95,56.35 v66.6,58
  Bottom 0.35: RA7.3A 67.5,58.9 v66.6,58
FPGA_EPI0S20  (via drill 0.35)
  Top 0.35: U4.56 52.35,37.75 v52.1,37.5
  Bottom 0.35: RA1.1A 61.9,36.3 58.6,33 55.6,33 52.1,36.5 v52.1,37.5
FPGA_EPI0S21  (via drill 0.35)
  Top 0.35: 55.37,34.23 v55.6,34 55.35,34.25 U4.62
  Bottom 0.35: v55.6,34 58.6,34 61.7,37.1 RA1.2A
FPGA_EPI0S22  (via drill 0.35)
  Top 0.35: v58.6,35 57.35,36.25 U4.66
  Bottom 0.35: RA1.3A 61.5,37.9 v58.6,35
FPGA_EPI0S23  (via drill 0.35)
  Top 0.35: U4.83 65.45,45.85 v65.6,46
  Bottom 0.35: RA3.4A 65.9,45.7 v65.6,46
FPGA_EPI0S24  (via drill 0.35)
  Top 0.35: 64.28,50.32 v64.6,50 64.25,50.35 U4.92
  Bottom 0.35: RA5.1A 64.9,50.3 v64.6,50
FPGA_EPI0S25  (via drill 0.35)
  Top 0.35: U4.93 65.45,50.85 v65.6,51
  Bottom 0.35: RA5.2A 65.7,51.1 v65.6,51
FPGA_EPI0S26  (via drill 0.35)
  Top 0.35: U4.105 64.45,56.85 v66.6,59
  Bottom 0.35: RA7.4A 67.3,59.7 v66.6,59
FPGA_EPI0S27  (via drill 0.35)
  Top 0.35: 59.37,61.77 v59.6,62 59.35,61.75 U4.111
  Bottom 0.35: RA8.1A 60.8,60.8 v59.6,62
FPGA_EPI0S28  (via drill 0.35)
  Top 0.35: v59.6,63 58.85,62.25 U4.112
  Bottom 0.35: RA8.2A 61,61.6 v59.6,63
FPGA_EPI0S29  (via drill 0.35)
  Top 0.35: v59.6,64 57.85,62.25 U4.114
  Bottom 0.35: RA8.3A 61.2,62.4 v59.6,64
FPGA_EPI0S30  (via drill 0.35)
  Top 0.35: v59.6,65 57.35,62.75 U4.115
  Bottom 0.35: RA8.4A 61.4,63.2 v59.6,65
FPGA_EPI0S31  (via drill 0.35)
  Top 0.35: U4.94 64.95,51.35 v65.6,52
  Bottom 0.35: RA5.3A 65.7,51.9 v65.6,52
FPGA_III_1  (via drill 0.35)
  Top 0.35: U4.35 39.35,41.35 v38,40
  Bottom 0.35: v38,40 37.9,39.9 37.9,36.1 42.5,31.5 47.2,31.5 53.2,25.5 RA24.1B
FPGA_III_2  (via drill 0.35)
  Top 0.35: U4.34 38.85,41.85 v38,41
  Bottom 0.35: v38,41 37.3,40.3 37.3,35.8 42.2,30.9 46.9,30.9 52.4,25.4 RA24.2B
FPGA_III_3  (via drill 0.35)
  Top 0.35: U4.33 38.35,42.35 v37,41
  Bottom 0.35: v37,41 36.7,40.7 36.7,35.5 41.9,30.3 46.6,30.3 51.6,25.3 RA24.3B
FPGA_III_4  (via drill 0.35)
  Top 0.35: U4.32 37.85,42.85 v37,42
  Bottom 0.35: v37,42 36.1,41.1 36.1,35.2 41.6,29.7 46.3,29.7 50.8,25.2 RA24.4B
FPGA_III_5  (via drill 0.35)
  Top 0.35: U4.30 37.85,43.85 v36,42
  Bottom 0.35: v36,42 35.5,41.5 35.5,34.9 41.3,29.1 46,29.1 49,26.1 49,25 48.7,24.7 RA25.1B
FPGA_III_6  (via drill 0.35)
  Top 0.35: U4.29 37.35,44.35 v36,43
  Bottom 0.35: v36,43 34.9,41.9 34.9,34.6 41,28.5 45.7,28.5 48.2,26 48.2,25.2 47.9,24.9 RA25.2B
FPGA_III_7  (via drill 0.35)
  Top 0.35: U4.27 37.35,45.35 v35,43
  Bottom 0.35: v35,43 34.3,42.3 34.3,34.3 40.7,27.9 45.4,27.9 46.8,26.5 46.8,25.2 47.1,24.9 RA25.3B
FPGA_III_8  (via drill 0.35)
  Top 0.35: U4.26 36.85,45.85 v35,44
  Bottom 0.35: v35,44 33.7,42.7 33.7,34 40.4,27.3 45.1,27.3 46,26.4 46,25 46.3,24.7 RA25.4B
FPGA_III_9  (via drill 0.35)
  Top 0.35: U4.24 36.85,46.85 v34,44
  Bottom 0.35: v34,44 33.1,43.1 33.1,33.7 40.1,26.7 43,26.7 44,25.7 44,24.5 43.7,24.2 RA26.1B
FPGA_III_10  (via drill 0.35)
  Top 0.35: U4.23 36.35,47.35 v34,45
  Bottom 0.35: v34,45 32.5,43.5 32.5,33.4 39.8,26.1 42.7,26.1 43.2,25.6 43.2,24.7 42.9,24.4 RA26.2B
FPGA_III_11  (via drill 0.35)
  Top 0.35: U4.22 35.85,47.85 v33,45
  Bottom 0.35: v33,45 31.9,43.9 31.9,33.1 39.5,25.5 41.2,25.5 42.1,24.6 RA26.3B
FPGA_III_12  (via drill 0.35)
  Top 0.35: U4.21 35.35,48.35 v33,46
  Bottom 0.35: v33,46 31.3,44.3 31.3,32.8 39.2,24.9 40.3,24.9 41.3,23.9 RA26.4B
FPGA_III_13  (via drill 0.35)
  Top 0.35: U4.17 36.35,50.35 v32,46
  Bottom 0.35: v32,46 30.7,44.7 30.7,32.5 39.2,24 RA27.1B
FPGA_III_14  (via drill 0.35)
  Top 0.35: U4.16 35.85,50.85 v32,47
  Bottom 0.35: v32,47 30.1,45.1 30.1,32.2 38.4,23.9 RA27.2B
FPGA_III_15  (via drill 0.35)
  Top 0.35: U4.15 35.35,51.35 v31,47
  Bottom 0.35: v31,47 29.5,45.5 29.5,31.9 37.6,23.8 RA27.3B
FPGA_III_16  (via drill 0.35)
  Top 0.35: U4.14 34.85,51.85 v31,48
  Bottom 0.35: v31,48 28.9,45.9 28.9,31.6 36.8,23.7 RA27.4B
FPGA_IV_1  (via drill 0.35)
  Top 0.35: U4.142 43.85,61.25 43,62.1 30.9,62.1 v28,65
  Bottom 0.35: v28,65 24.8,68.2 RA31.1B
FPGA_IV_2  (via drill 0.35)
  Top 0.35: U4.141 44.35,61.65 43.3,62.7 31.3,62.7 v29,65
  Bottom 0.35: RA31.2B 25.6,68.4 v29,65
FPGA_IV_3  (via drill 0.35)
  Top 0.35: U4.140 44.85,62.05 43.6,63.3 31.7,63.3 v30,65
  Bottom 0.35: RA31.3B 26.4,68.6 v30,65
FPGA_IV_4  (via drill 0.35)
  Top 0.35: U4.139 45.35,62.45 43.9,63.9 32.1,63.9 v31,65
  Bottom 0.35: RA31.4B 27.2,68.8 v31,65
FPGA_IV_5  (via drill 0.35)
  Top 0.35: U4.138 45.85,62.85 44.2,64.5 32.5,64.5 v32,65
  Bottom 0.35: v32,65 29,68 29,75 29.3,75.3 RA32.1B
FPGA_IV_6  (via drill 0.35)
  Top 0.35: U4.137 46.35,63.25 44.5,65.1 32.9,65.1 v32,66
  Bottom 0.35: RA32.2B 30.1,75.1 29.8,74.8 29.8,68.2 v32,66
FPGA_IV_7  (via drill 0.35)
  Top 0.35: U4.134 47.85,62.65 44.8,65.7 33.3,65.7 v33,66
  Bottom 0.35: RA32.3B 30.9,75.1 31.2,74.8 31.2,67.8 v33,66
FPGA_IV_8  (via drill 0.35)
  Top 0.35: U4.133 48.35,63.05 45.1,66.3 33.7,66.3 v33,67
  Bottom 0.35: RA32.4B 31.7,75.3 32,75 32,68 v33,67
FPGA_IV_9  (via drill 0.35)
  Top 0.35: U4.132 48.85,63.45 45.4,66.9 37.1,66.9 v35,69
  Bottom 0.35: RA33.1B 34.3,75.3 34,75 34,70 v35,69
FPGA_IV_10  (via drill 0.35)
  Top 0.35: U4.131 49.35,63.85 45.7,67.5 37.5,67.5 v36,69
  Bottom 0.35: RA33.2B 35.1,75.1 34.8,74.8 34.8,70.2 v36,69
FPGA_IV_11  (via drill 0.35)
  Top 0.35: U4.127 51.35,62.75 46,68.1 37.9,68.1 v37,69
  Bottom 0.35: RA33.3B 35.9,75.1 36.2,74.8 36.2,69.8 v37,69
FPGA_IV_12  (via drill 0.35)
  Top 0.35: U4.126 51.85,63.15 46.3,68.7 38.3,68.7 v38,69
  Bottom 0.35: RA33.4B 36.7,75.3 37,75 37,70 v38,69
FPGA_IV_13  (via drill 0.35)
  Top 0.35: U4.124 52.85,63.05 46.6,69.3 40.7,69.3 v39,71
  Bottom 0.35: RA34.1B 38.8,71.2 v39,71
FPGA_IV_14  (via drill 0.35)
  Top 0.35: U4.123 53.35,63.45 46.9,69.9 41.1,69.9 v40,71
  Bottom 0.35: RA34.2B 39.6,71.4 v40,71
FPGA_IV_15  (via drill 0.35)
  Top 0.35: U4.121 54.35,63.35 47.2,70.5 41.5,70.5 v41,71
  Bottom 0.35: RA34.3B 40.4,71.6 v41,71
FPGA_IV_16  (via drill 0.35)
  Top 0.35: U4.120 54.85,63.75 47.5,71.1 42.4,71.1 v42,71.5
  Bottom 0.35: RA34.4B 41.2,72.3 v42,71.5
FPGA_OSC
  Top 0.35: U4.51 49.85,37.29 Q2.3
FPGA_RUPT0  (via drill 0.35)
  Top 0.35: U4.117 56.35,66.25 v55.6,67
  Bottom 0.35: v55.6,67 56.4,66.2 57.8,66.2 58.5,66.9 60.6,66.9 61.6,65.9 RA9.2B
FPGA_RUPT1  (via drill 0.35)
  Top 0.35: U4.116 56.85,66.75 v56.6,67
  Bottom 0.35: v56.6,67 56.8,66.8 57.5,66.8 58.2,67.5 60.9,67.5 61.7,66.7 RA9.1B
FPGA_RUPT2  (via drill 0.35)
  Top 0.35: U4.119 55.35,65.25 v54.6,66
  Bottom 0.35: v54.6,66 55.6,65 58.4,65 59.1,65.7 60,65.7 61.4,64.3 RA9.4B
FPGA_RUPT3  (via drill 0.35)
  Top 0.35: U4.118 55.85,65.75 v55.6,66
  Bottom 0.35: v55.6,66 56,65.6 58.1,65.6 58.8,66.3 60.3,66.3 61.5,65.1 RA9.3B
FPGA_TCK
  Top 0.35: U4.109 60.35,61.05 62.3,63 68,63 77.65,72.65 R10.2 77.65,75.65 79,77 80,77 82,79 X23.6
FPGA_TDI
  Top 0.35: U4.110 59.85,61.35 62.1,63.6 67.6,63.6 76.15,72.15 R9.2 76.15,77.15 78,79 X23.10
FPGA_TDO  (via drill 0.35)
  Top 0.35: U4.106 63.95,57.35 66.6,60 67,60 v78,71
  Bottom 0.35: R11.1 80,73 v78,71
FPGA_TMS
  Top 0.35: U4.107 63.45,57.85 66.3,60.7 66.7,60.7 78,72 82,72 82.65,72.65 R8.1 82.65,78.65 84,80 X23.4
G901
  Bottom 1: R901.2 C901.1 153.85,6.15 G901.1
G902
  Bottom 1: C902.1 R902.2 80.15,6.15 G902.1
G903
  Bottom 1: C903.1 R903.2 6.15,6.15 G903.1
G904
  Bottom 1: R904.2 C904.1 6.15,93.85 G904.1
G905
  Bottom 1: R905.2 C905.1 80.15,93.85 G905.1
G906
  Bottom 1: C906.1 R906.2 153.85,93.85 G906.1
G907
  Bottom 1: R907.2 20.85,50 | 20.85,50 C907.1 | G907.1 20.85,50
GND  (via drill 0.35, 0.36, 0.8)  (1 unrouted)
  Top 0.24: 103.41,54.52 v102.98,54.52 103.41,54.52 | v94,54.31 93.44,54.31 U1.114 | D1.2 v140,63.5 | L1.2 v83.6,33 | U1.48 103.06,45.26 v103.06,45.55 | U1.80 103.41,54.52 | U1.17 96.38,47.5 v97.5,47.5 | U1.58 105.77,48.2 v105.7,48.2 | U1.55 104.98,47.3 v104.8,47.3
  Top 0.25: v147,40 147.5,40 149,41.5 149,45 145,49 140,49 134.5,43.5 v133.5,43.5 | v126,43 v112,43
  Top 0.35: C58.2 78.75,23.65 v78.9,23.5 79.05,23.65 R17.1 | X23.13 v74,83 | X23.11 v76,83 | X23.9 v78,83 | X23.7 v80,83 | X23.5 v82,83 | X23.3 v84,83 | X23.1 v86,83 | SW1.3 153.5,86.5 v154,86 | SW1.4 153.5,83.5 v154,84 | Q1.4 116.8,56.5 v117.1,56.8 | Q1.2 v109.8,58.7 | X24.3 123.56,65.36 v123.6,65.4 | X24.5 123.53,66.64 v123.6,66.7 | U4.49 48.85,40.15 v48.2,40.8 | U4.54 51.35,39.95 52.2,40.8 v53,40.8 | U4.68 58.35,39.95 57.5,40.8 v56.3,40.8 | U4.73 60.95,40.85 v60.9,40.8 | U4.77 60.95,42.85 v60.2,43.6 | U4.91 61.15,49.85 v60.2,50.8 | U4.96 60.25,52.35 v60.2,52.3 | U4.108 60.85,58.35 v60.2,57.7 | U4.113 58.35,58.85 v57.7,58.2 | U4.130 49.85,58.75 v49.3,58.2 | U4.136 46.85,58.75 v46.3,58.2 | U4.3 42.25,57.35 v42.8,57.9 | U4.13 42.55,52.35 v42.8,52.1 | U4.25 42.25,46.35 v42.8,46.9 | R30.1 v135,53
  Top 0.4: C52.2 86.85,48.85 v87,49 | U3.2 79.6,49.6 v79.5,49.5 79.5,50.95 C55.2 C54.2 | v102.5,25.5
  Top 0.5: C14.2 72.75,73.25 v73,73 | C15.2 81.05,74.15 v80.8,74.4 | Q2.2 53,31.4 v53.7,32.1
  Top 0.6: X3.7 v57.5,25.5 | X3.8 v56.5,25.5 | X3.9 v55.5,25.5 | X3.10 v54.5,25.5 | X3.17 v47.5,25.5 | X3.22 v42.5,25.2 | X3.29 v35.5,23.5 | X3.34 v30.5,25.5 | X3.41 v23.5,25.5 | X3.42 v22.5,25.5 | X3.43 v21.5,25.5 | X3.44 v20.5,25.5 | X1.44 v102.5,25.5 | X1.43 v103.5,25.5 | X1.42 v104.5,25.5 | X1.41 v105.5,25.5 | X1.34 v112.5,25.5 | X1.29 v117.5,25.5 | X1.22 v124.5,25.5 | X1.17 v129.5,25.5 | X1.10 v136.5,25.5 | X1.9 v137.5,25.5 | X1.8 v138.5,25.5 | X1.7 v139.5,25.5 | X2.7 v102.5,74.5 | X2.8 v103.5,74.5 | X2.9 v104.5,74.5 | X2.10 v105.5,74.5 | X2.17 v112.5,74.5 | X2.22 v117.5,74.5 | X2.29 v124.5,74.5 | X2.34 v129.5,74.5 | X2.41 v136.5,74.5 | X2.42 v137.5,74.5 | X2.43 v138.5,74.5 | X2.44 v139.5,74.5 | X4.7 v20.5,74.5 | X4.8 v21.5,74.5 | X4.9 v22.5,74.5 | X4.10 v23.5,74.5 | X4.17 v30.5,74.5 | X4.22 v35.5,74.5 | X4.29 v42.5,74.5 | X4.34 v47.5,74.5 | X4.41 v54.5,74.5 | X4.42 v55.5,74.5 | X4.43 v56.5,74.5 | X4.44 v57.5,74.5
  Top 0.8: U6.2 v23,54 | U2.2 v23,36 | U2.4 v23,46 | U6.4 v23,64
  Bottom 0.24: 100.34,46.74 C6.2 | 102.91,54.52 v102.98,54.52 | U5.4 v78.91,23.5 | C60.2 v88.4,35.9
  Bottom 0.35: v78.91,23.5 v78.9,23.5 | C51.2 149.25,80.25 v149,80 | v117.1,56.8 116.7,56.4 C50.2 | C49.2 109.9,58.8 v109.8,58.7 | R22.1 v112,50.1
  Bottom 0.4: T1.2 136.15,68.95 | T3.2 131.15,68.95 | T2.2 126.15,68.95
  Bottom 0.45: 136.15,68.95 v136.1,69 | 131.15,68.95 v131.1,69 | 126.15,68.95 v126.1,69
  Bottom 0.5: C62.2 138.15,37.15 v138,37.3 | C61.2 138.05,40.95 v138,41 | T4.2 137,34.05 v137,35 | T5.2 142,34.05 v142,35 | C53.2 97.2,47.5 v97.5,47.5 | C1.2 92.59,47.17 v92.52,47.17 92.52,47.1 C2.2 | C3.2 95.91,43.71 v95.98,43.71 95.98,43.78 C4.2 | C5.2 99.24,41.66 v99.17,41.66 | C8.2 103.06,44.91 v103.06,45.55 | 100.34,46.74 101.08,47.48 v101.08,47.52 101.15,47.52 C7.2 | C9.2 v103.55,52.12 | C45.2 102.91,54.52 v102.98,54.52 102.98,55.02 C10.2 | C11.2 99.24,58.34 v99.24,58.27 | C12.2 96.05,56.72 v96.05,56.36 96.44,56.36 C16.2 | C42.2 C13.2 90.1,50.7 v90.39,50.7 | C48.2 94.22,54.31 v94,54.31 94,54.52 C46.2 C47.2 | C34.2 46.65,40.85 v46.7,40.8 46.65,40.75 C33.2 | C22.2 48.15,40.85 v48.2,40.8 | C29.2 53.05,40.85 v53,40.8 | C35.2 56.25,40.85 v56.3,40.8 56.15,40.65 R7.1 | C37.2 60.65,44.05 v60.2,43.6 | C36.2 60.25,45.75 v60.2,45.7 | C21.2 57.75,45.75 v57.5,45.5 | C27.2 60.15,50.85 v60.2,50.8 60.25,50.85 C26.2 | C38.2 60.15,57.65 v60.2,57.7 | C30.2 54.25,59.25 55.3,58.2 v56,58.2 55.95,58.15 C32.2 | C28.2 49.35,58.25 v49.3,58.2 49.35,58.15 C20.2 | C31.2 46.25,58.15 v46.3,58.2 | C41.2 42.85,57.95 v42.8,57.9 | C39.2 42.75,52.05 v42.8,52.1 | C24.2 42.85,46.95 v42.8,46.9 42.75,46.95 C23.2 | C19.2 45.25,43.75 v45.5,44 | C40.2 42.75,45.45 v42.8,45.5 | C25.2 42.35,40.15 v42.8,40.6 | R1.1 v39.9,35.9 | C59.2 52.3,33.5 v53.7,32.1 | C63.2 130,41 v131,40 | C64.2 133,45 v134,46
  Bottom 0.8: C56.2 C17.2 22.85,36.15 v23,36 23,33.16 TP4.1 | v23,54 22.85,54.15 C43.2 22.85,58.43 TP5.1 | C44.2 28.85,58.65 v28.5,59 | C18.2 C57.2 25.45,43.45 v26,44
  Bottom 1: C906.2 R906.1 v148,90 | R902.1 C902.2 88.85,7.85 91,10 v91,11 | v12,90 C904.2 R904.1 | v89,93 88.15,92.15 R905.1 C905.2 | R903.1 C903.2 15.15,7.85 v15.5,7.5 | v150,9 148.85,7.85 C901.2 R901.1 | C907.2 19.15,50 | 19.15,50 R907.1 | 19.15,50 v17,50 | L5.1 v146,53
  pour InnerSolder: 160,100 0,100 0,0 160,0
GNDA
  Top 0.24: L1.1 83.6,36.4 84,36.8 84,39.08 U1.10
INIT  (via drill 0.35)
  Top 0.24: v98.6,35 99.6,36 99.6,39.3 98.5,40.4 98.5,52.2 101.9,55.6 101.9,56.41 U1.86
  Top 0.35: LD2.C 73.9,34.9 v74,34.8 | U4.39 43.85,36.25 v43.6,36
  Bottom 0.24: 51.6,36 55.6,32 61.1,32 63.6,34.5 73.7,34.5 v74,34.8 74.3,34.5 87.4,34.5 89.4,32.5 93.4,32.5 96.4,35.5 98.1,35.5 v98.6,35
  Bottom 0.25: 51.6,36 49.85,36 R3.1
  Bottom 0.35: v43.6,36 49.15,36 R3.1
  Bottom 0.5: TP20.1 44.5,36.9 v43.6,36
M0  (via drill 0.35)
  Top 0.35: U4.69 58.85,40.65 v58.3,41.2
  Bottom 0.5: R6.1 v58.3,41.2 59.3,41.2 TP10.1
M1  (via drill 0.35)
  Top 0.35: U4.60 54.35,37.55 v54.4,37.5
  Bottom 0.5: R7.2 54.45,37.55 v54.4,37.5 54.4,36.4 TP9.1
MCU_I_1  (via drill 0.35)
  Top 0.24: v100.6,35 100.8,35.2 100.8,39.6 U1.34
  Bottom 0.24: v100.6,35 102.1,33.5 130.7,33.5 135.2,29 RA10.1B
MCU_I_2  (via drill 0.35)
  Top 0.24: v99.6,35 100.3,35.7 100.3,39.53 U1.33
  Bottom 0.24: v99.6,35 101.6,33 130.4,33 134.4,29 RA10.2B
MCU_I_3  (via drill 0.35)
  Top 0.24: v95.5,32.5 95.5,39.83 U1.29
  Bottom 0.24: v95.5,32.5 96,33 97,33 97.5,32.5 130.1,32.5 133.6,29 RA10.3B
MCU_I_4  (via drill 0.35)
  Top 0.24: v96.5,32.4 96,32.9 96,39.76 U1.30
  Bottom 0.24: RA10.4B 132.8,29 129.8,32 96.9,32 v96.5,32.4
MCU_I_5  (via drill 0.35)
  Top 0.24: v88,32 87.7,32.3 87.7,39.95 U1.15
  Bottom 0.24: v88,32 88.5,31.5 128.5,31.5 131,29 131,25 130.7,24.7 RA11.1B
MCU_I_6  (via drill 0.35)
  Top 0.24: v87,32 87.2,32.2 87.2,40.01 U1.14
  Bottom 0.24: v87,32 88,31 128.3,31 130.3,29 130.3,25.3 129.9,24.9 RA11.2B
MCU_I_7  (via drill 0.35)
  Top 0.24: v86,32 86.7,32.7 86.7,40.08 U1.13
  Bottom 0.24: v86,32 87.5,30.5 127.2,30.5 128.7,29 128.7,25.3 129.1,24.9 RA11.3B
MCU_I_8  (via drill 0.35)
  Top 0.24: v85,32 86.2,33.2 86.2,40.15 U1.12
  Bottom 0.24: v85,32 87,30 127,30 128,29 128,25 128.3,24.7 RA11.4B
MCU_I_9  (via drill 0.35)
  Top 0.24: v114.6,54 113.5,55.1 107.38,55.1 U1.74
  Bottom 0.24: RA12.1B 114.3,53.7 v114.6,54
MCU_I_10  (via drill 0.35)
  Top 0.24: v113.6,54 113,54.6 107.44,54.6 U1.73
  Bottom 0.24: RA12.2B 113.5,53.9 v113.6,54
MCU_I_11  (via drill 0.35)
  Top 0.24: v81.5,33 79,35.5 79,37.47 U1.4
  Bottom 0.24: v81.5,33 85,29.5 120.7,29.5 123.2,27 RA13.1B
MCU_I_12  (via drill 0.35)
  Top 0.24: v80.5,33 78.5,35 78.5,37.54 U1.3
  Bottom 0.24: v80.5,33 84.5,29 120.4,29 122.4,27 RA13.2B
MCU_I_13  (via drill 0.35)
  Top 0.24: v79.5,33 78,34.5 78,37.1 78,37.6 U1.2
  Bottom 0.24: v79.5,33 84,28.5 120.1,28.5 121.6,27 RA13.3B
MCU_I_14  (via drill 0.35)
  Top 0.24: v78.5,33 77.5,34 77.5,37.67 U1.1
  Bottom 0.24: v78.5,33 83.5,28 119.8,28 120.8,27 RA13.4B
MCU_I_15  (via drill 0.35)
  Top 0.24: v77.5,33 77,33.5 77,37.9 78.5,39.4 78.5,54 79.5,55 84.83,55 U1.128
  Bottom 0.24: v77.5,33 83,27.5 117.5,27.5 119,26 119,25 118.7,24.7 RA14.1B
MCU_I_16  (via drill 0.35)
  Top 0.24: v76.5,33 76.5,38.1 78,39.6 78,54.2 79.3,55.5 84.9,55.5 U1.127
  Bottom 0.24: v76.5,33 82.5,27 117.3,27 118.3,26 118.3,25.3 117.9,24.9 RA14.2B
MCU_II_1  (via drill 0.35)
  Top 0.24: v99.6,66.5 100.2,65.9 100.2,60.37 U1.96
  Bottom 0.24: v99.6,66.5 99.4,66.7 90.6,66.7 89.6,67.7 89.6,69 95.3,74.7 95.3,75 96,75.7 106.5,75.7 106.8,76 RA17.1B
MCU_II_2  (via drill 0.35)
  Top 0.24: v100.6,68 100.7,67.9 100.7,60.3 U1.95
  Bottom 0.24: v100.6,68 99.8,67.2 90.8,67.2 90.1,67.9 90.1,68.8 95.8,74.5 95.8,74.8 96.2,75.2 107.1,75.2 107.6,75.7 RA17.2B
MCU_II_3  (via drill 0.35)
  Top 0.24: v91.6,68 89.6,66 89.6,62.11 U1.107
  Bottom 0.24: v91.6,68 91.6,69 96.1,73.5 107.8,73.5 108.4,74.1 RA17.3B
MCU_II_4  (via drill 0.35)
  Top 0.24: v92.6,68 91.9,68.7 91.3,68.7 89.1,66.5 89.1,62.05 U1.108
  Bottom 0.24: v92.6,68 92.6,69 96.6,73 108,73 109.2,74.2 RA17.4B
MCU_II_5  (via drill 0.35)
  Top 0.24: v93.6,68 92.4,69.2 91.1,69.2 88.6,66.7 88.6,61.98 U1.109
  Bottom 0.24: v93.6,68 93.6,69 97.1,72.5 110.7,72.5 111.3,73.1 RA18.1B
MCU_II_6  (via drill 0.35)
  Top 0.24: v94.6,68 92.9,69.7 90.9,69.7 88.1,66.9 88.1,61.91 U1.110
  Bottom 0.24: v94.6,68 94.6,69 97.6,72 110.9,72 111.8,72.9 111.8,74.8 112.1,75.1 RA18.2B
MCU_II_7  (via drill 0.35)
  Top 0.24: v95.6,69 94.4,70.2 90.7,70.2 87.6,67.1 87.6,61.85 U1.111
  Bottom 0.24: v95.6,69 98.1,71.5 111.8,71.5 113.2,72.9 113.2,74.8 112.9,75.1 RA18.3B
MCU_II_8  (via drill 0.35)
  Top 0.24: v96.6,69 94.9,70.7 90.5,70.7 87.1,67.3 87.1,61.78 U1.112
  Bottom 0.24: v96.6,69 98.6,71 112,71 113.7,72.7 RA18.4B
MCU_II_9  (via drill 0.35)
  Top 0.24: v115.6,54 114.6,53 113.6,53 112.5,54.1 107.51,54.1 U1.72
  Bottom 0.24: v115.6,54 118,56.4 118,73.1 116.3,74.8 RA19.1B
MCU_II_10  (via drill 0.35)
  Top 0.24: v116.6,54 115.1,52.5 113.4,52.5 112.3,53.6 107.57,53.6 U1.71
  Bottom 0.24: v116.6,54 118.5,55.9 118.5,74.5 117.1,75.9 RA19.2B
MCU_II_11  (via drill 0.35)
  Top 0.24: v86,69 84,67 84,59.9 89.8,54.1 90.26,54.1 U1.120
  Bottom 0.24: v86,69 98,81 98,86 99.8,87.8 RA20.1A
MCU_II_12  (via drill 0.35)
  Top 0.24: v86,70 83.5,67.5 83.5,59.8 89.6,53.7 90.09,53.7 U1.121
  Bottom 0.24: v86,70 97.5,81.5 97.5,86.2 99.9,88.6 RA20.2A
MCU_II_13  (via drill 0.35)
  Top 0.24: v85,70 83,68 83,59.66 U1.123
  Bottom 0.24: v85,70 97,82 97,86.4 100,89.4 RA20.3A
MCU_II_14  (via drill 0.35)
  Top 0.24: v85,71 82.5,68.5 82.5,59.59 U1.124
  Bottom 0.24: v85,71 96.5,82.5 96.5,86.6 100.1,90.2 RA20.4A
MCU_II_15  (via drill 0.35)
  Top 0.24: v84,71 82,69 82,59.53 U1.125
  Bottom 0.24: v84,71 96,83 96,86.8 100.2,91 124.1,91 124.3,90.8 RA21.1A
MCU_II_16  (via drill 0.35)
  Top 0.24: v84,72 81.5,69.5 81.5,59.46 U1.126
  Bottom 0.24: v84,72 95.5,83.5 95.5,87 100,91.5 124.4,91.5 125.1,90.8 RA21.2A
MCU_TCK  (via drill 0.35)
  Top 0.24: v96.6,68 95.4,66.8 95.4,60.27 U1.100
  Top 0.35: X24.4 114.23,65.36 v113.6,66
  Bottom 0.24: v96.6,68 99.1,70.5 112.1,70.5 113.8,68.8 113.8,66.2 v113.6,66
MCU_TDI  (via drill 0.35)